# Altium schematic sheet TransPrj.SchDoc
size A0
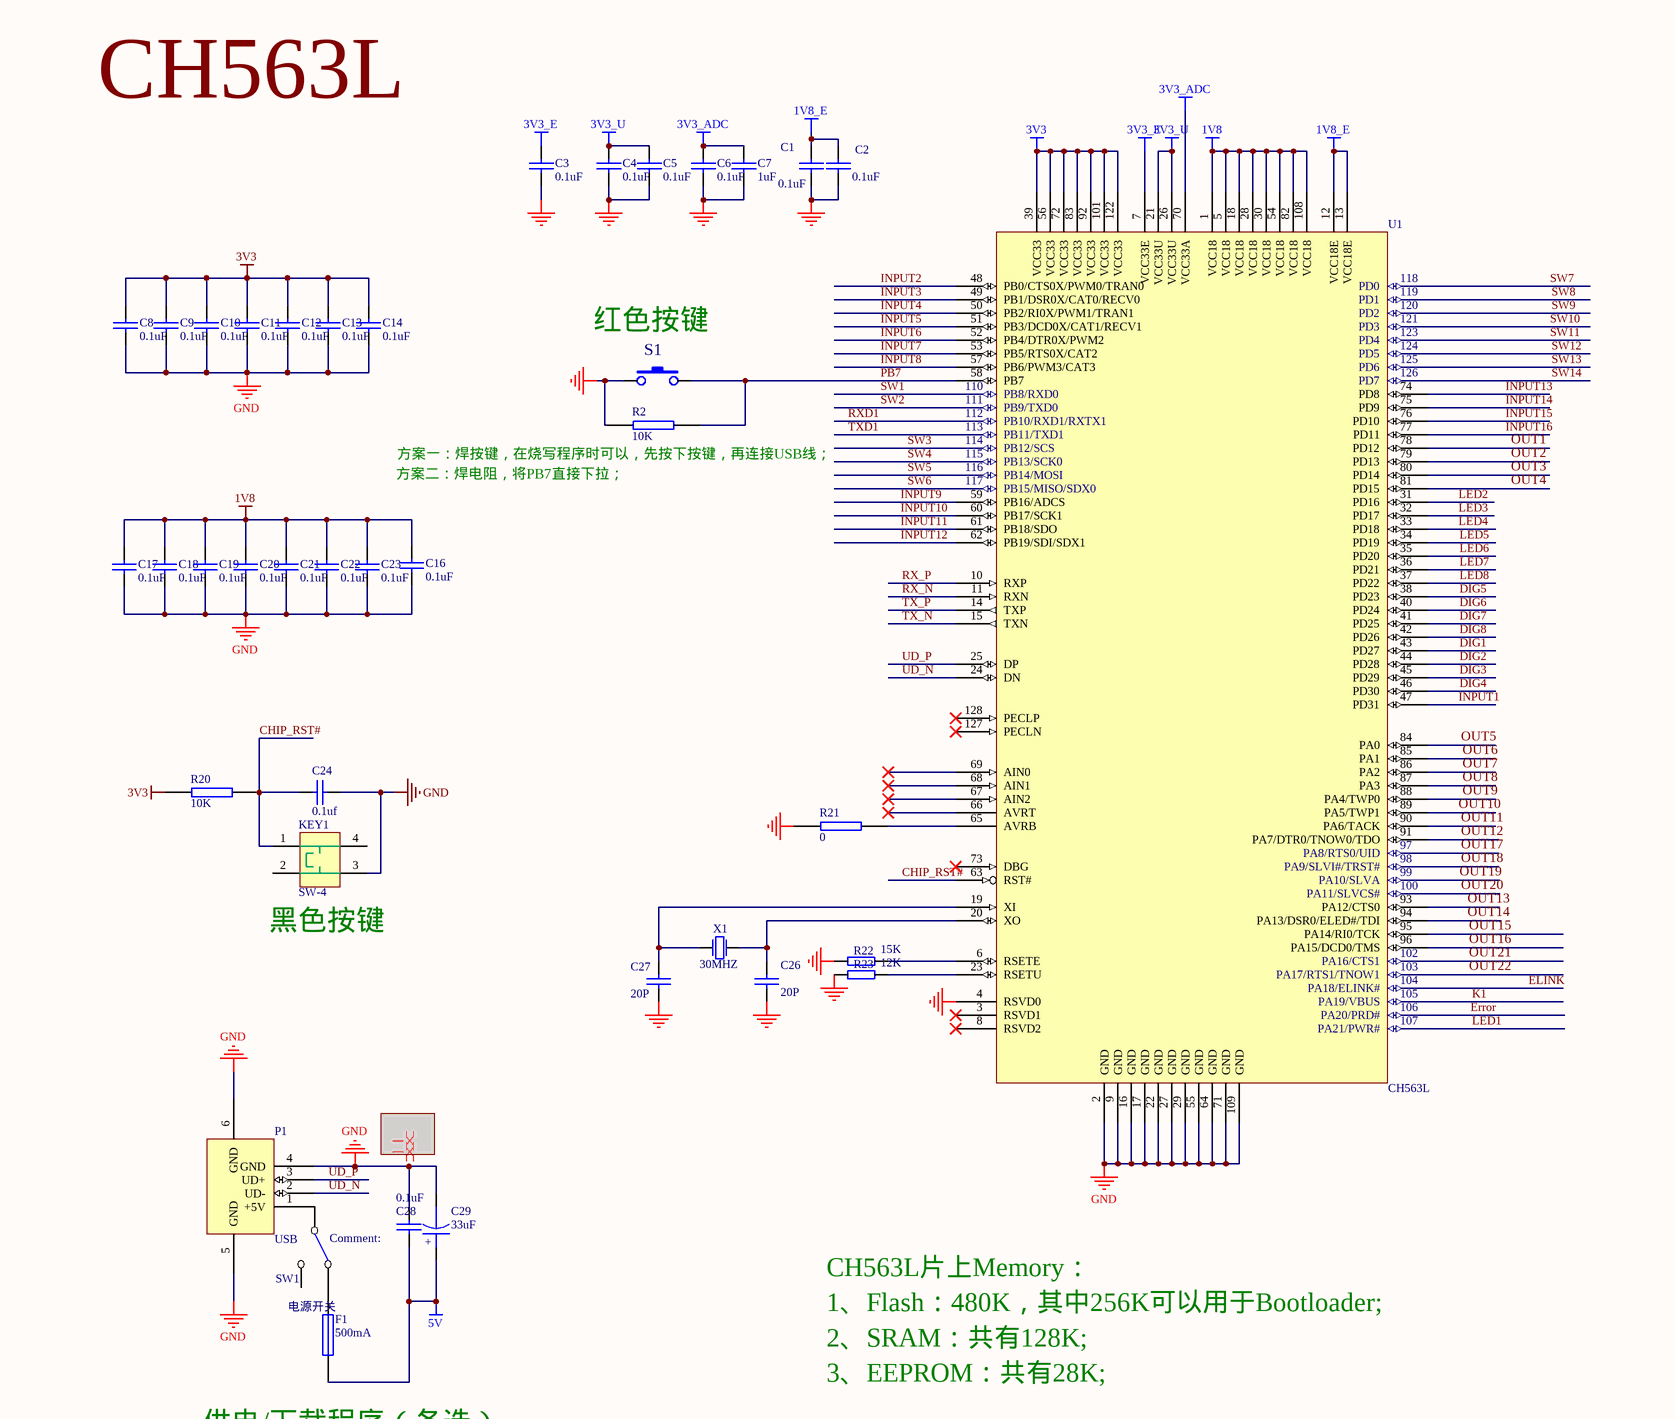
[diagram p0: TransPrj.SchDoc, top left]
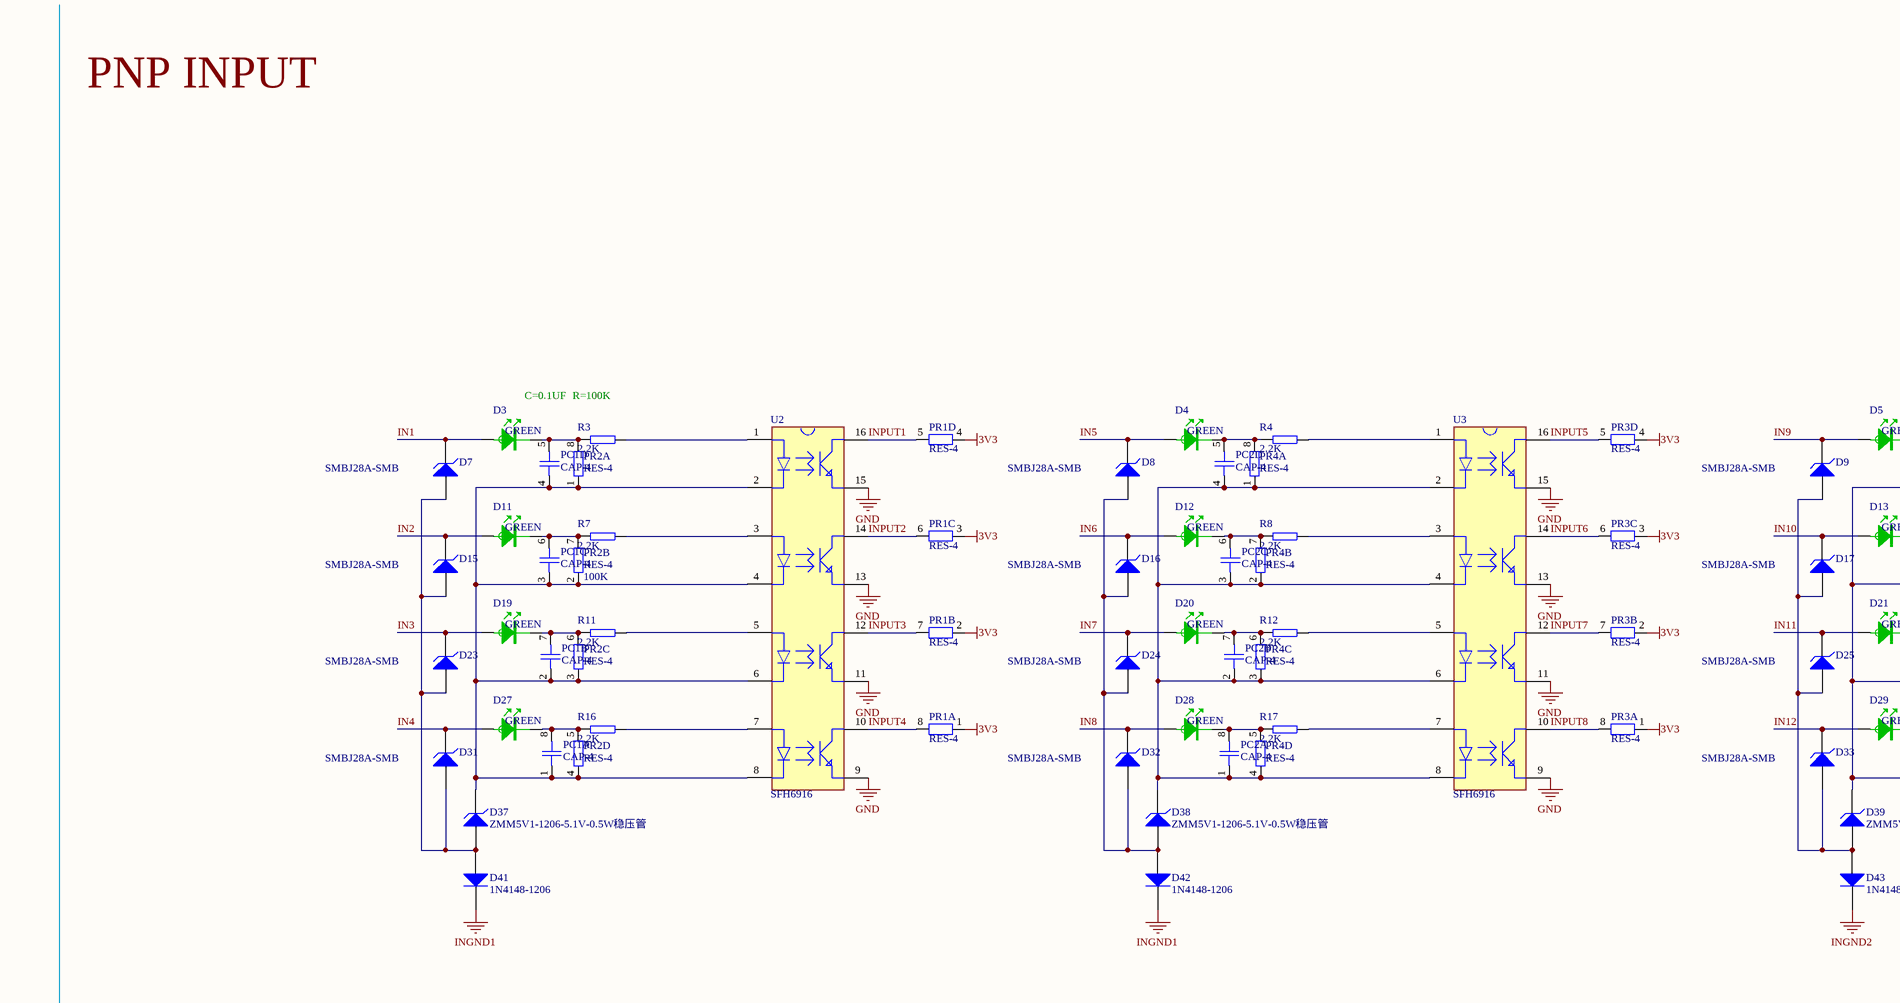
[diagram p1: TransPrj.SchDoc, top middle]
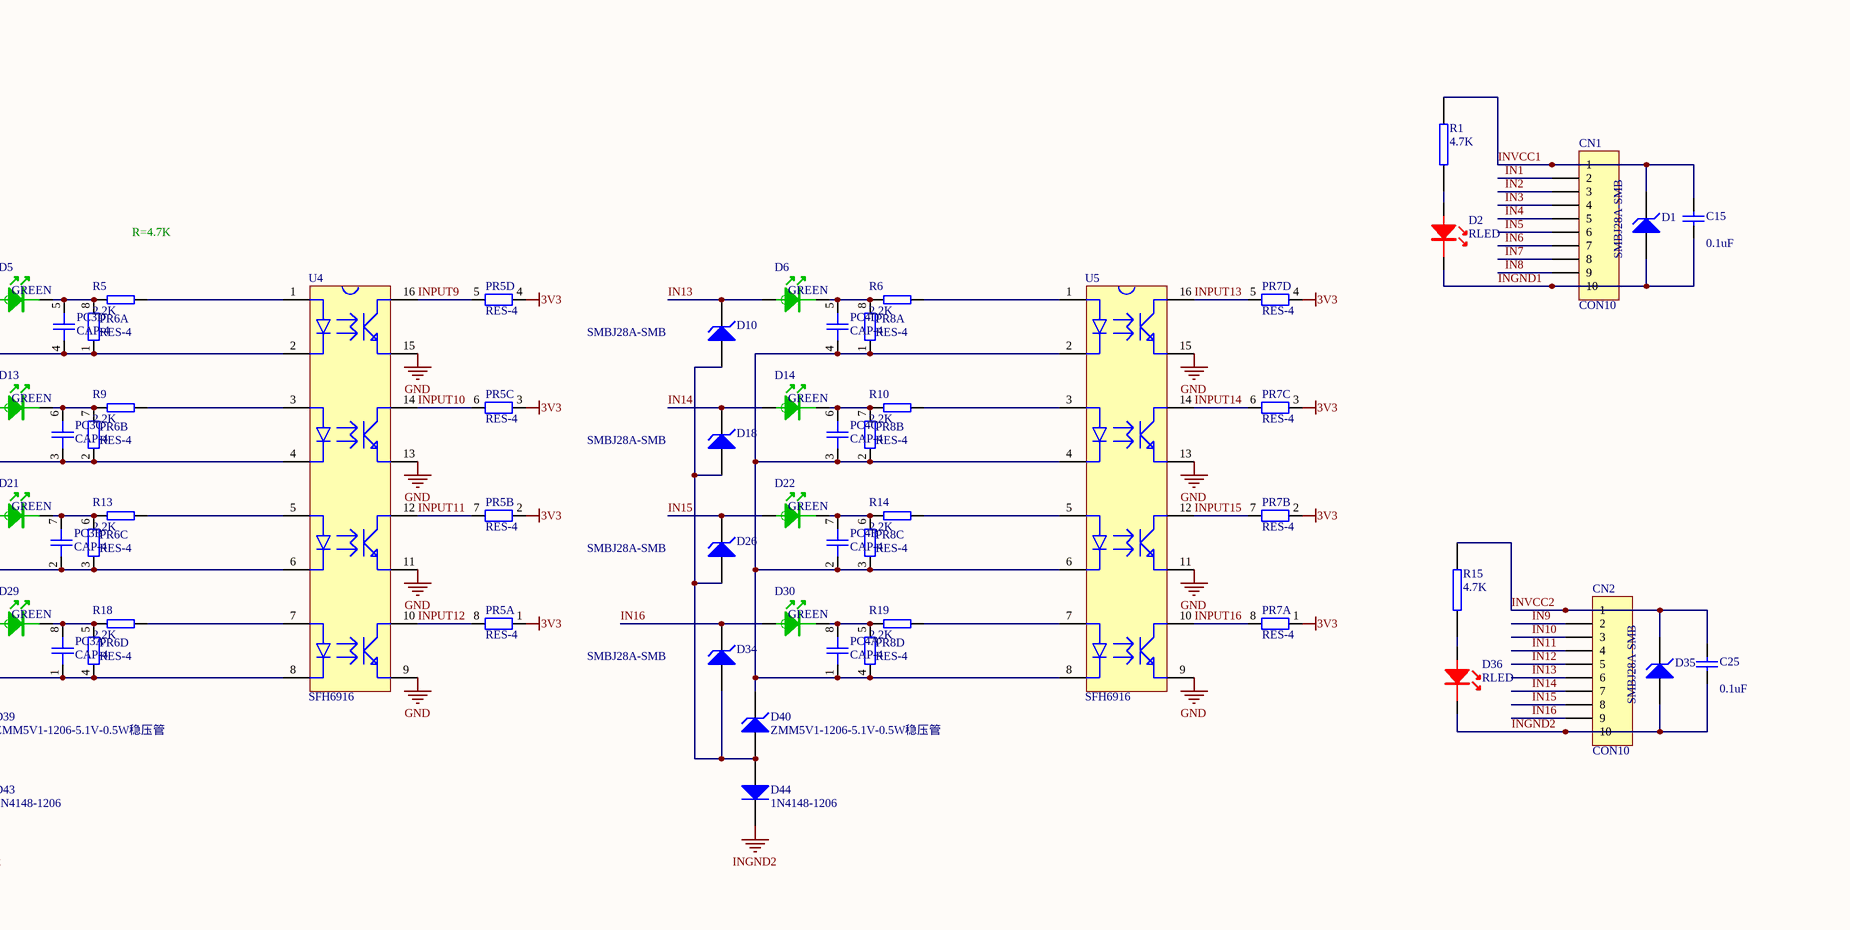
[diagram p2: TransPrj.SchDoc, top right]
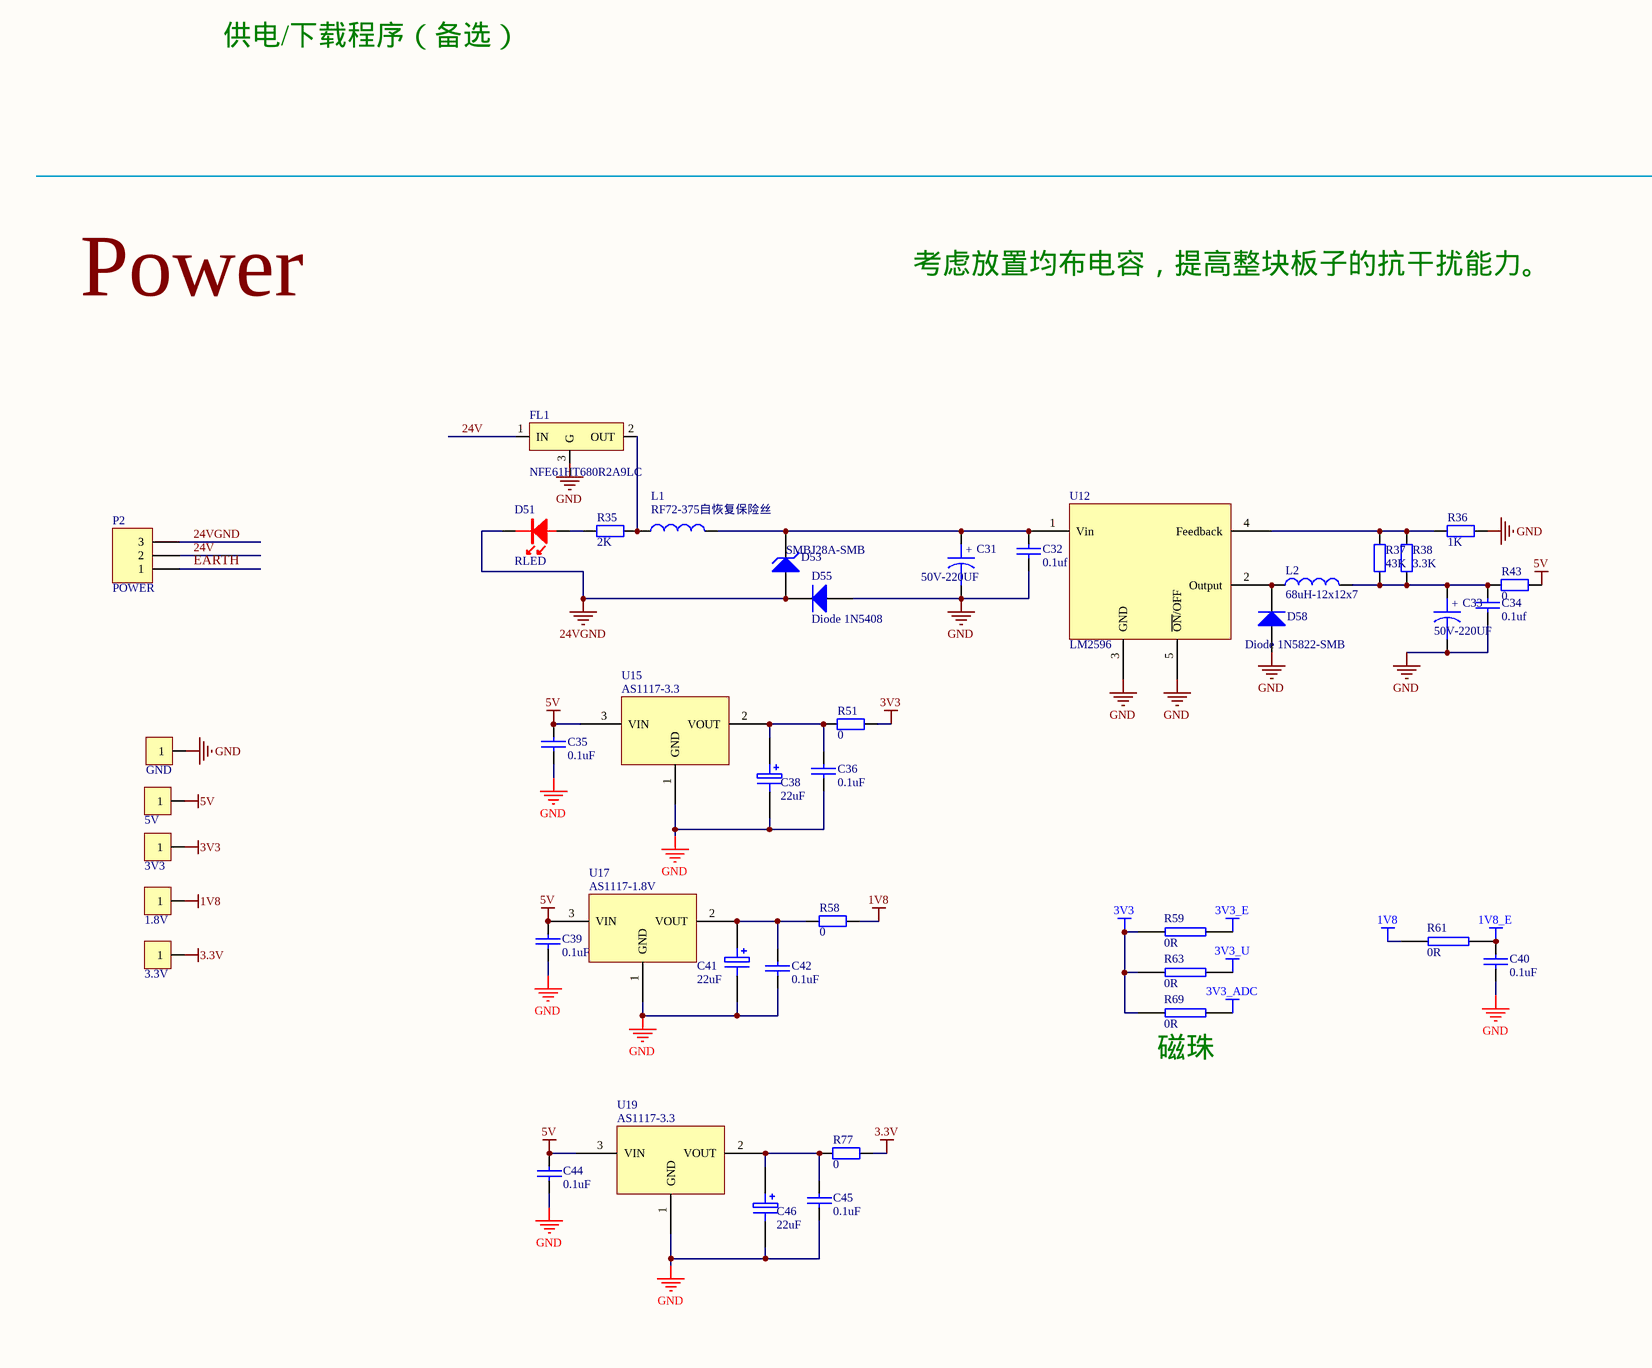
[diagram p3: TransPrj.SchDoc, centre left]
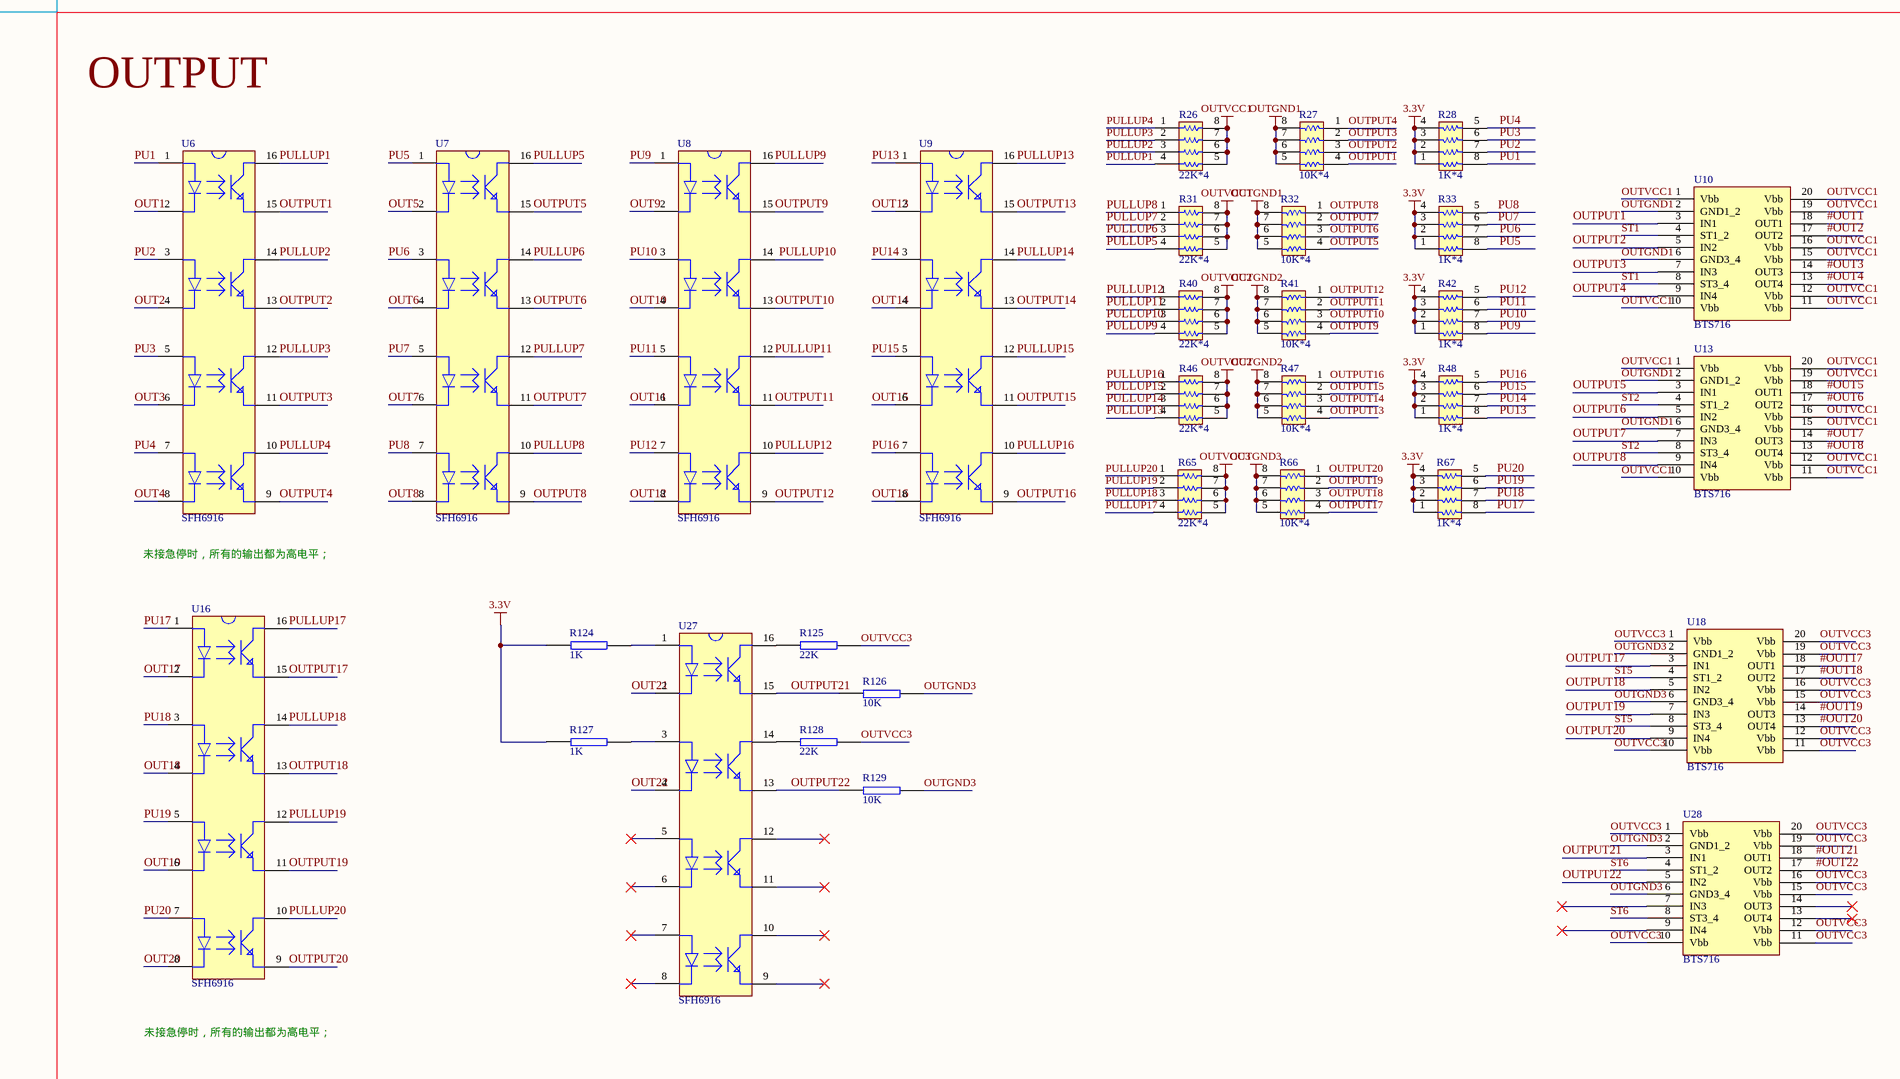
[diagram p4: TransPrj.SchDoc, centre middle]
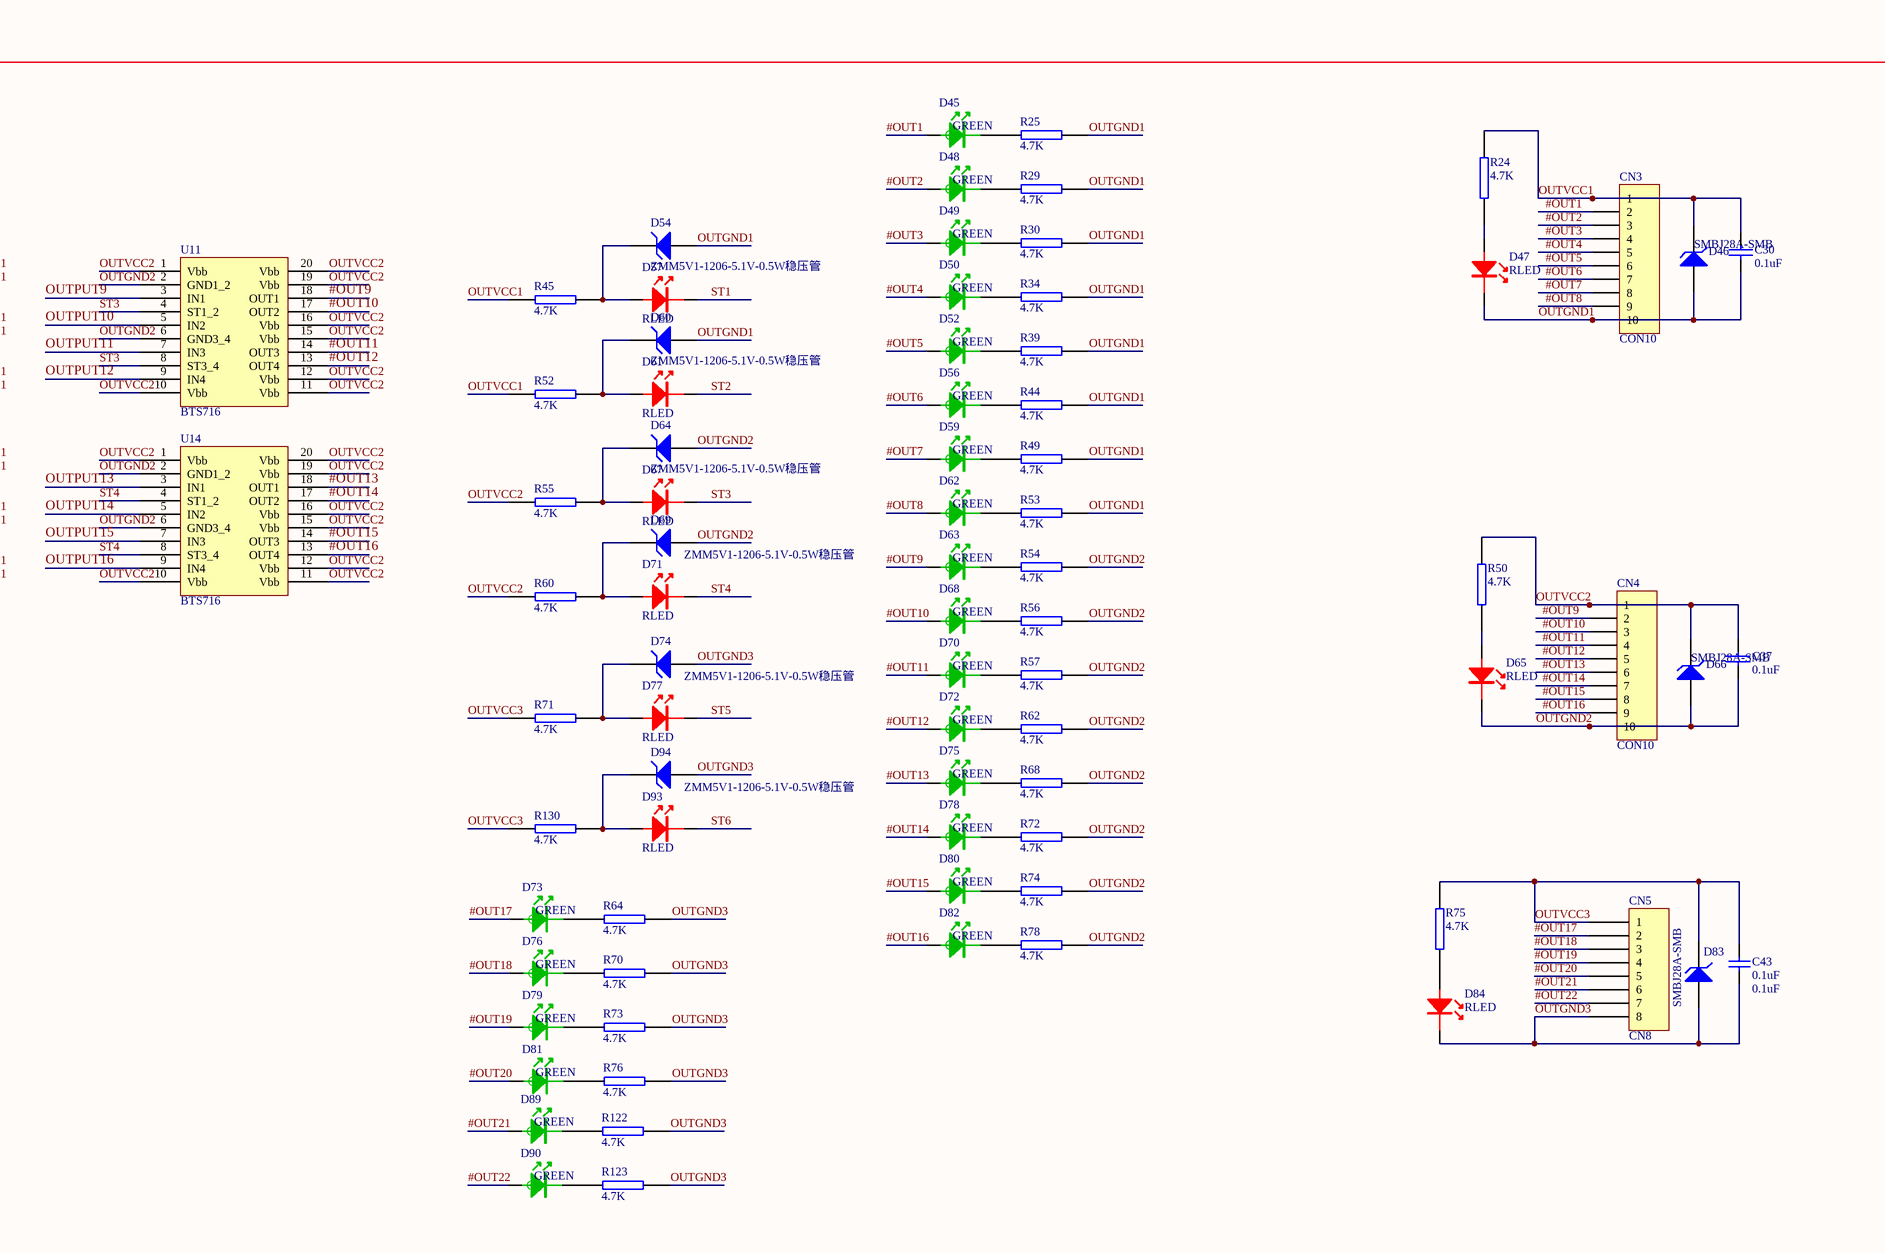
[diagram p5: TransPrj.SchDoc, centre right]
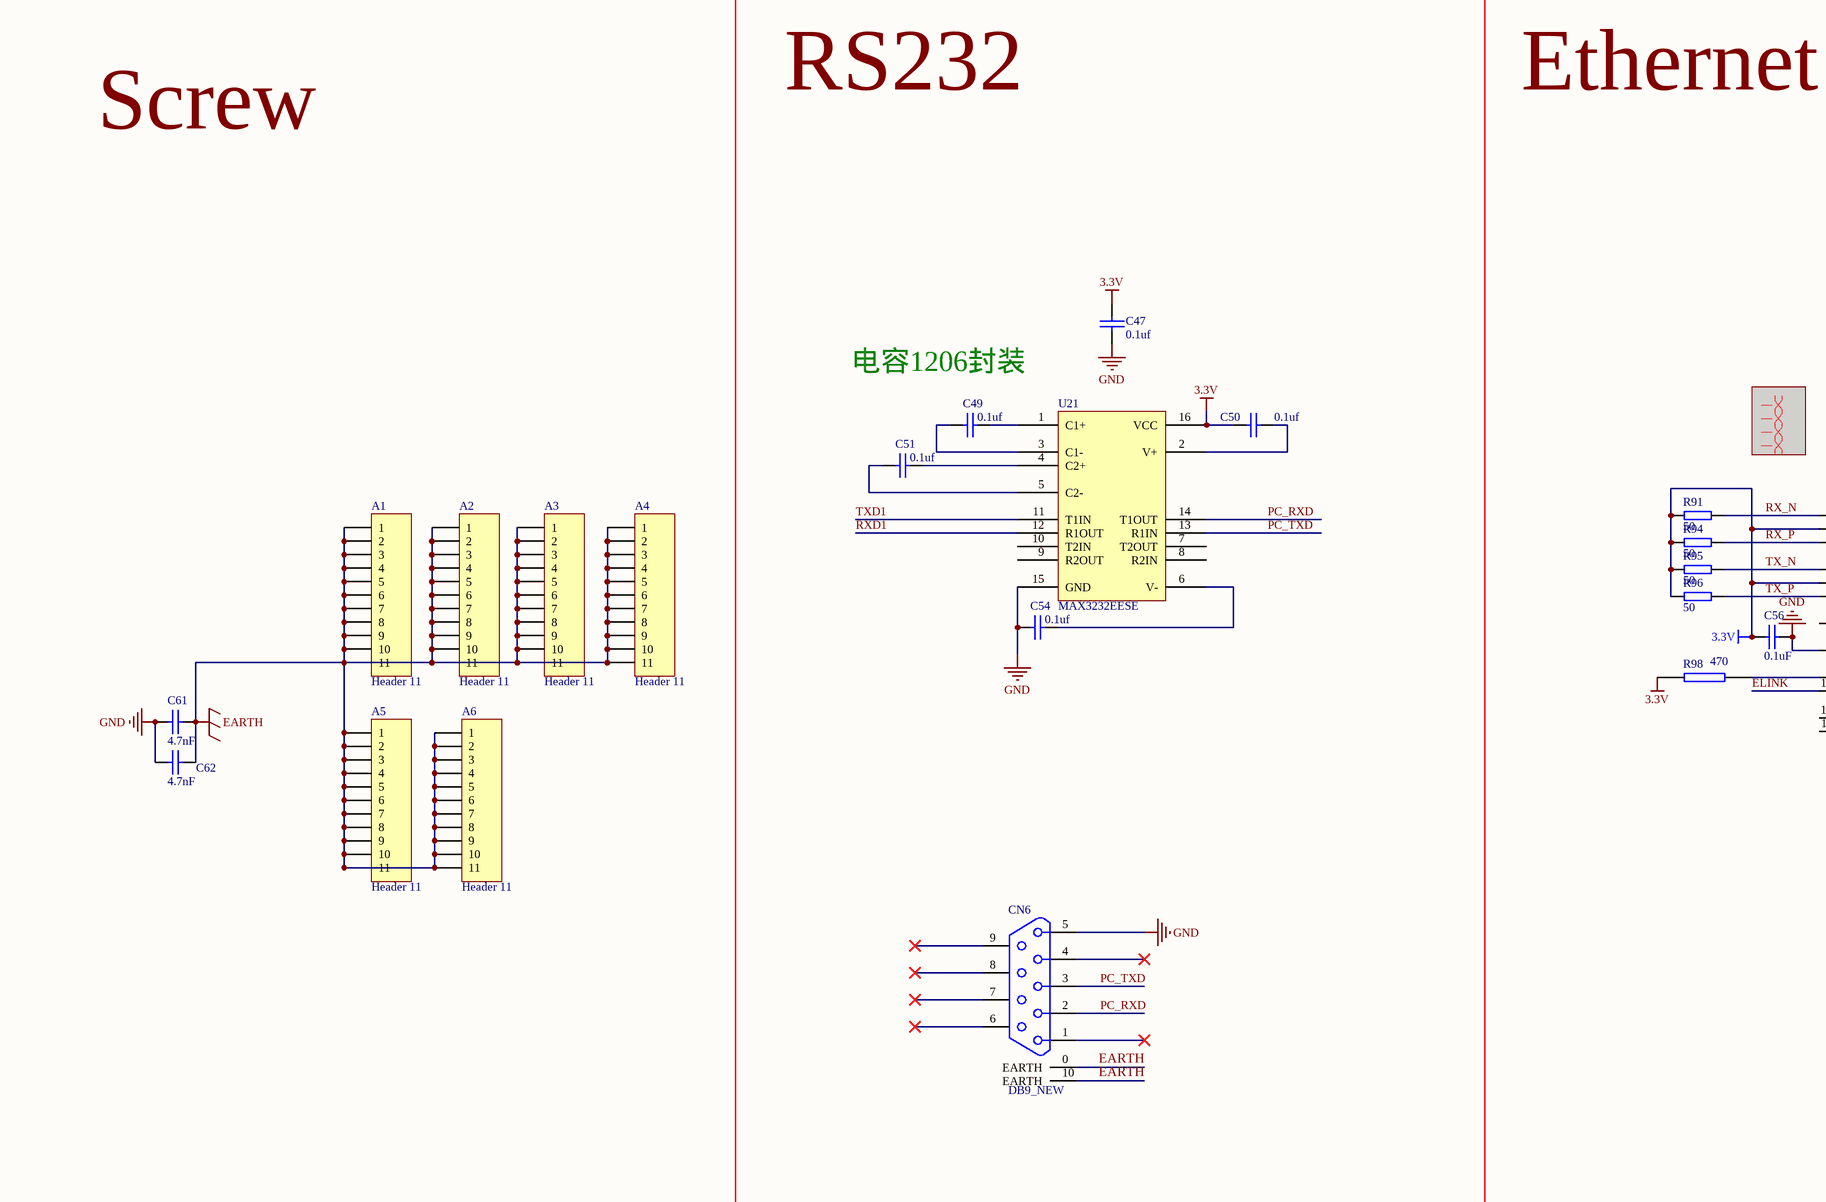
[diagram p6: TransPrj.SchDoc, bottom left]
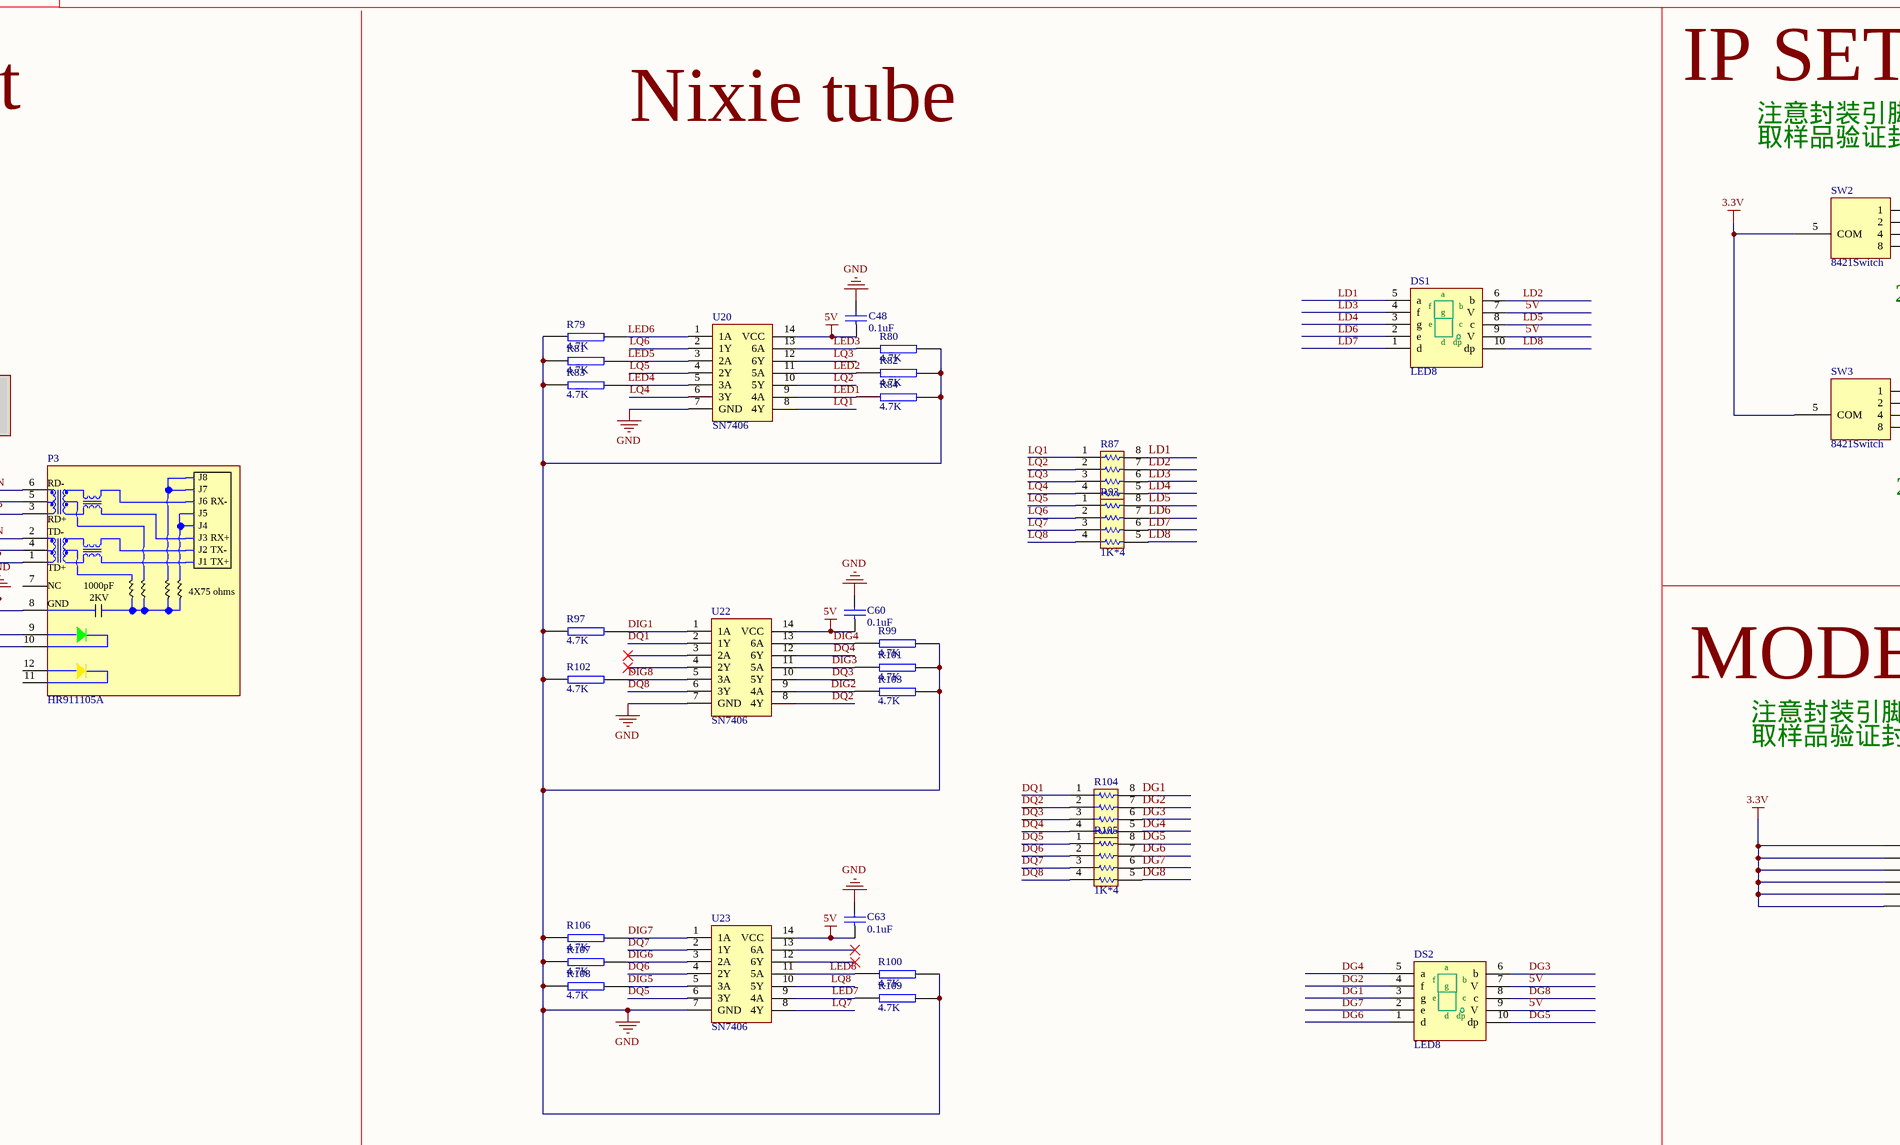
[diagram p7: TransPrj.SchDoc, bottom middle]
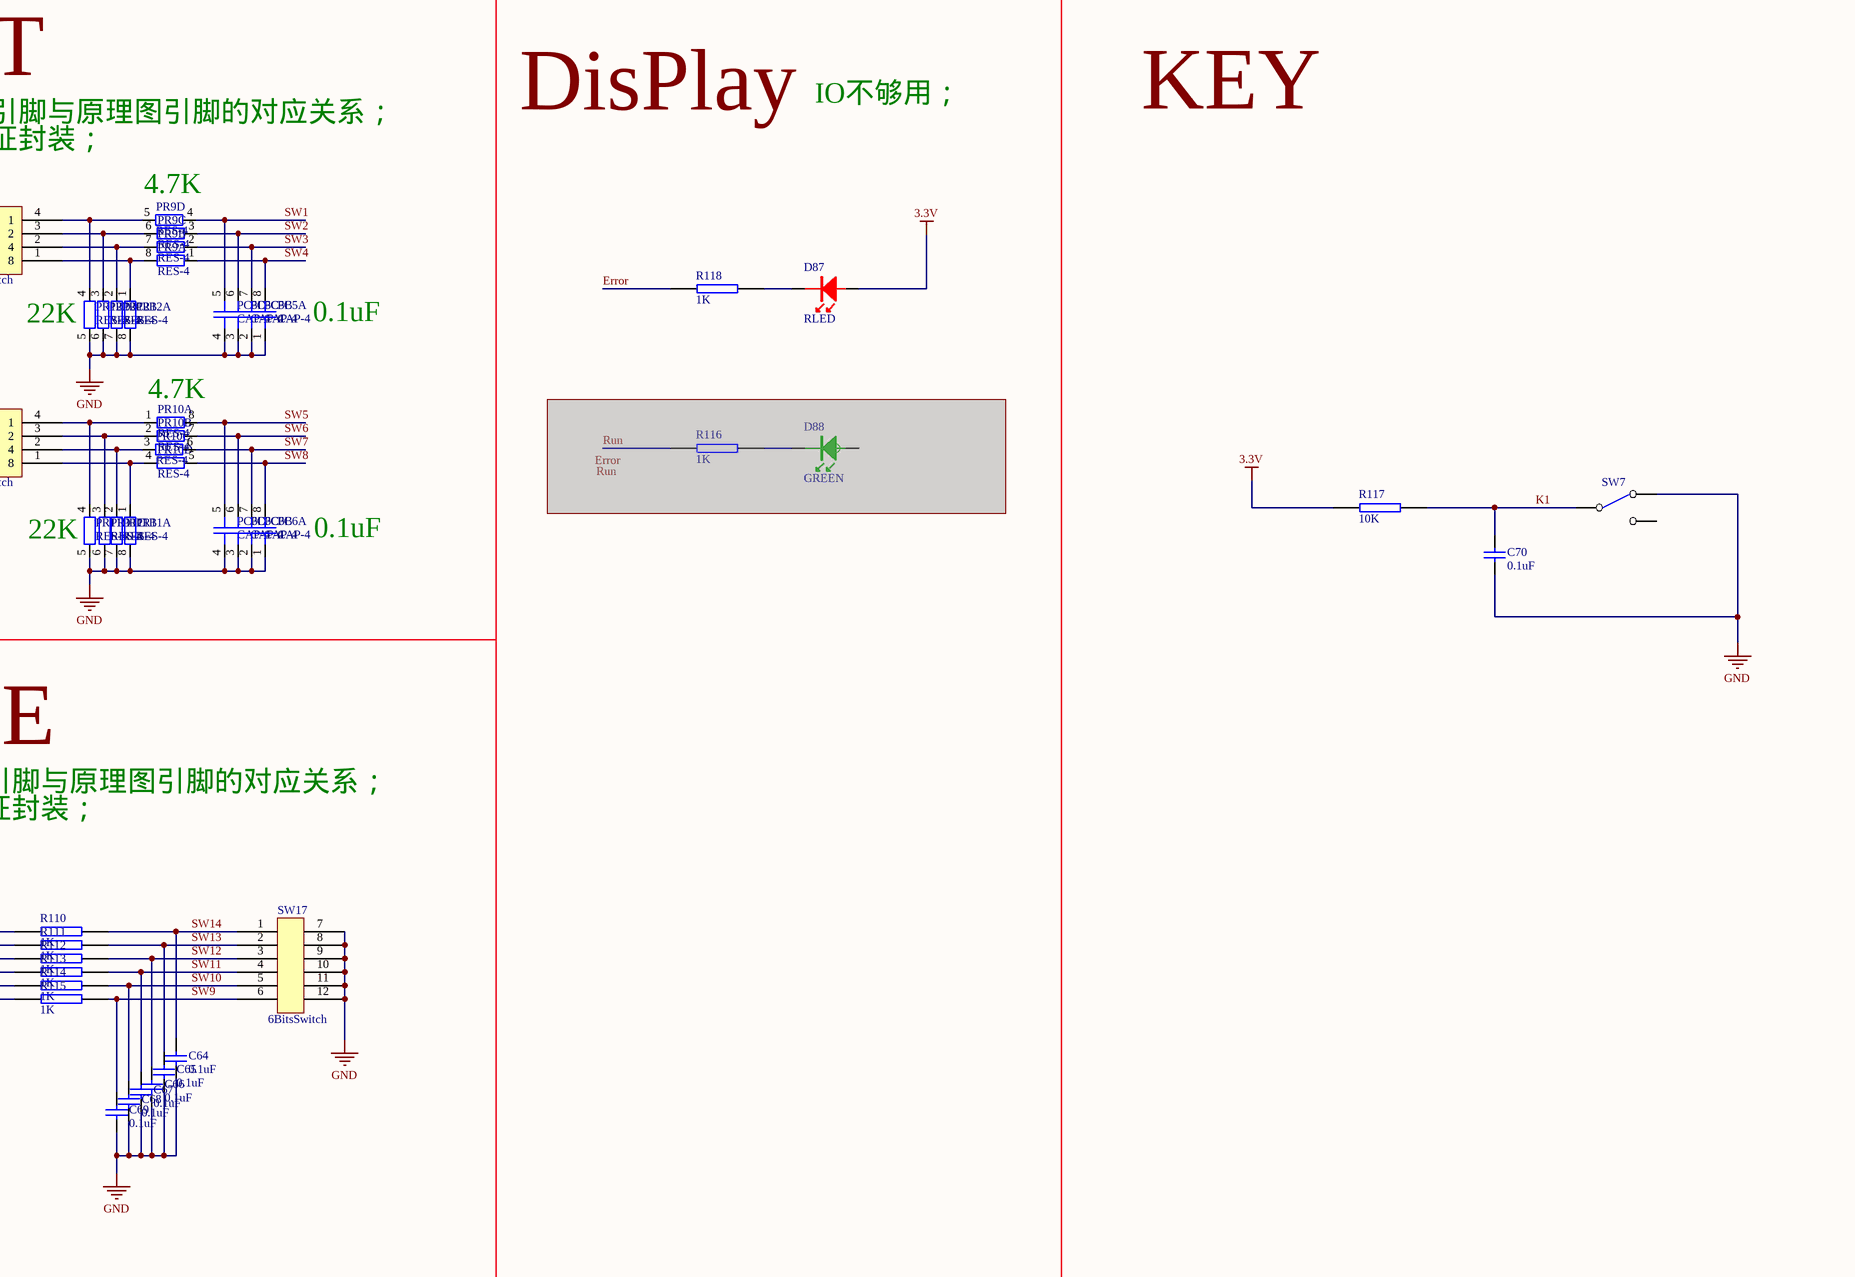
[diagram p8: TransPrj.SchDoc, bottom right]

## Parts
1.8V  TESTPOINT  [TESTPOINT]  (value not drawn)
3.3V  TESTPOINT  [TESTPOINT]  (value not drawn)
3V3  TESTPOINT  [TESTPOINT]  (value not drawn)
5V  TESTPOINT  [TESTPOINT]  (value not drawn)
A1  Header 11  [m3]
A2  Header 11  [m3]
A3  Header 11  [m3]
A4  Header 11  [m3]
A5  Header 11  [m3]
A6  Header 11  [m3]
C1  0.1uF  [0805_CAP]
C2  0.1uF  [0805_CAP]
C3  0.1uF  [0805_CAP]
C4  0.1uF  [0805_CAP]
C5  0.1uF  [0805_CAP]
C6  0.1uF  [0805_CAP]
C7  1uF  [0805_CAP]
C8  0.1uF  [0805_CAP]
C9  0.1uF  [0805_CAP]
C10  0.1uF  [0805_CAP]
C11  0.1uF  [0805_CAP]
C12  0.1uF  [0805_CAP]
C13  0.1uF  [0805_CAP]
C14  0.1uF  [0805_CAP]
C15  0.1uF  [0805_CAP]
C16  0.1uF  [0805_CAP]
C17  0.1uF  [0805_CAP]
C18  0.1uF  [0805_CAP]
C19  0.1uF  [0805_CAP]
C20  0.1uF  [0805_CAP]
C21  0.1uF  [0805_CAP]
C22  0.1uF  [0805_CAP]
C23  0.1uF  [0805_CAP]
C24  0.1uf  [0805_CAP]
C25  0.1uF  [0805_CAP]
C26  20P  [0805_CAP]
C27  20P  [0805_CAP]
C28  0.1uF  [0805_CAP]
C29  33uF  [3528]
C30  0.1uF  [0805_CAP]
C31  50V-220UF  [50V220UF]
C32  0.1uf  [0805_CAP]
C33  50V-220UF  [50V220UF]
C34  0.1uf  [0805_CAP]
C35  0.1uF  [0805_CAP]
C36  0.1uF  [0805_CAP]
C37  0.1uF  [0805_CAP]
C38  22uF  [3528]
C39  0.1uF  [0805_CAP]
C40  0.1uF  [0805_CAP]
C41  22uF  [3528]
C42  0.1uF  [0805_CAP]
C43  0.1uF  [0805_cap]
C44  0.1uF  [0805_CAP]
C45  0.1uF  [0805_CAP]
C46  22uF  [3528]
C47  0.1uf  [0805_CAP]
C48  0.1uF  [0603C]
C49  0.1uf  [1206]
C50  0.1uf  [1206]
C51  0.1uf  [1206]
C54  0.1uf  [1206]
C56  0.1uF  [0805_CAP]
C60  0.1uF  [0603C]
C61  4.7nF  [WIMA-CAP]
C62  4.7nF  [WIMA-CAP]
C63  0.1uF  [0603C]
C64  value 0.1uF  [0603C]  (hidden comment: Cap)
C65  value 0.1uF  [0603C]  (hidden comment: Cap)
C66  value 0.1uF  [0603C]  (hidden comment: Cap)
C67  value 0.1uF  [0603C]  (hidden comment: Cap)
C68  value 0.1uF  [0603C]  (hidden comment: Cap)
C69  value 0.1uF  [0603C]  (hidden comment: Cap)
C70  value 0.1uF  [0603C]  (hidden comment: Cap)
CN1  CON10  [I/O-10P]
CN2  CON10  [I/O-10P]
CN3  CON10  [I/O-10P]
CN4  CON10  [I/O-10P]
CN5  CN8  [8-FOOT]
CN6  DB9_NEW  [DB9/F_NEW(母头)]
D1  SMBJ28A-SMB  [SMB]
D2  RLED  [0805_POL]
D3  GREEN  [0805_pol]
D4  GREEN  [0805_pol]
D5  GREEN  [0805_pol]
D6  GREEN  [0805_pol]
D7  SMBJ28A-SMB  [SMB]
D8  SMBJ28A-SMB  [SMB]
D9  SMBJ28A-SMB  [SMB]
D10  SMBJ28A-SMB  [SMB]
D11  GREEN  [0805_pol]
D12  GREEN  [0805_pol]
D13  GREEN  [0805_pol]
D14  GREEN  [0805_pol]
D15  SMBJ28A-SMB  [SMB]
D16  SMBJ28A-SMB  [SMB]
D17  SMBJ28A-SMB  [SMB]
D18  SMBJ28A-SMB  [SMB]
D19  GREEN  [0805_pol]
D20  GREEN  [0805_pol]
D21  GREEN  [0805_pol]
D22  GREEN  [0805_pol]
D23  SMBJ28A-SMB  [SMB]
D24  SMBJ28A-SMB  [SMB]
D25  SMBJ28A-SMB  [SMB]
D26  SMBJ28A-SMB  [SMB]
D27  GREEN  [0805_pol]
D28  GREEN  [0805_pol]
D29  GREEN  [0805_pol]
D30  GREEN  [0805_pol]
D31  SMBJ28A-SMB  [SMB]
D32  SMBJ28A-SMB  [SMB]
D33  SMBJ28A-SMB  [SMB]
D34  SMBJ28A-SMB  [SMB]
D35  SMBJ28A-SMB  [SMB]
D36  RLED  [0805_POL]
D37  ZMM5V1-1206-5.1V-0.5W稳压管  [1206_P]
D38  ZMM5V1-1206-5.1V-0.5W稳压管  [1206_P]
D39  ZMM5V1-1206-5.1V-0.5W稳压管  [1206_P]
D40  ZMM5V1-1206-5.1V-0.5W稳压管  [1206_P]
D41  1N4148-1206  [1206_P]
D42  1N4148-1206  [1206_P]
D43  1N4148-1206  [1206_P]
D44  1N4148-1206  [1206_P]
D45  GREEN  [0805_pol]
D46  SMBJ28A-SMB  [SMB]
D47  RLED  [0805_POL]
D48  GREEN  [0805_pol]
D49  GREEN  [0805_pol]
D50  GREEN  [0805_pol]
D51  RLED  [DIP-2]
D52  GREEN  [0805_pol]
D53  SMBJ28A-SMB  [SMB]
D54  ZMM5V1-1206-5.1V-0.5W稳压管  [1206_P]
D55  Diode 1N5408  [bigdiode]
D56  GREEN  [0805_pol]
D57  RLED  [0805_POL]
D58  Diode 1N5822-SMB  [SMB]
D59  GREEN  [0805_pol]
D60  ZMM5V1-1206-5.1V-0.5W稳压管  [1206_P]
D61  RLED  [0805_POL]
D62  GREEN  [0805_pol]
D63  GREEN  [0805_pol]
D64  ZMM5V1-1206-5.1V-0.5W稳压管  [1206_P]
D65  RLED  [0805_POL]
D66  SMBJ28A-SMB  [SMB]
D67  RLED  [0805_POL]
D68  GREEN  [0805_pol]
D69  ZMM5V1-1206-5.1V-0.5W稳压管  [1206_P]
D70  GREEN  [0805_pol]
D71  RLED  [0805_POL]
D72  GREEN  [0805_pol]
D73  GREEN  [0805_pol]
D74  ZMM5V1-1206-5.1V-0.5W稳压管  [1206_P]
D75  GREEN  [0805_pol]
D76  GREEN  [0805_pol]
D77  RLED  [0805_POL]
D78  GREEN  [0805_pol]
D79  GREEN  [0805_pol]
D80  GREEN  [0805_pol]
D81  GREEN  [0805_pol]
D82  GREEN  [0805_pol]
D83  SMBJ28A-SMB  [SMB]
D84  RLED  [0805_POL]
D87  RLED  [0805_POL]
D88  GREEN  [0805_pol]  (masked out: inside a compile mask, not in the netlist)
D89  GREEN  [0805_pol]
D90  GREEN  [0805_pol]
D93  RLED  [0805_POL]
D94  ZMM5V1-1206-5.1V-0.5W稳压管  [1206_P]
DS1  LED8  [10LED]
DS2  LED8  [10LED]
F1  500mA  [0805]
FL1  NFE61HT680R2A9LC  [LONG]
GND  TESTPOINT  [TESTPOINT]  (value not drawn)
KEY1  SW-4  [SW]
L1  RF72-375自恢复保险丝  [AXIAL-0.4]
L2  68uH-12x12x7  [INDM125120X70N]
P1  USB  [USBA_L]
P2  POWER  [POWER3l]
P3  HR911105A  [RJ45A]
PC1  CAP-4  [0603-4]  (parts A,B,C,D of 4)
PC2  CAP-4  [0603-4]  (parts A,B,C,D of 4)
PC3  CAP-4  [0603-4]  (parts A,B,C,D of 4)
PC4  CAP-4  [0603-4]  (parts A,B,C,D of 4)
PC5  CAP-4  [0603-4]  (parts A,B,C,D of 4)
PC6  CAP-4  [0603-4]  (parts A,B,C,D of 4)
PR1  RES-4  [0603-4]  (parts A,B,C,D of 4)
PR2  RES-4  [0603-4]  (parts A,B,C,D of 4)
PR3  RES-4  [0603-4]  (parts A,B,C,D of 4)
PR4  RES-4  [0603-4]  (parts A,B,C,D of 4)
PR5  RES-4  [0603-4]  (parts A,B,C,D of 4)
PR6  RES-4  [0603-4]  (parts A,B,C,D of 4)
PR7  RES-4  [0603-4]  (parts A,B,C,D of 4)
PR8  RES-4  [0603-4]  (parts A,B,C,D of 4)
PR9  RES-4  [0603-4]  (parts A,B,C,D of 4)
PR10  RES-4  [0603-4]  (parts A,B,C,D of 4)
PR11  RES-4  [0603-4]  (parts A,B,C,D of 4)
PR12  RES-4  [0603-4]  (parts A,B,C,D of 4)
R1  4.7K  [0805]
R2  10K  [0805]
R3  2.2K  [1206]
R4  2.2K  [1206]
R5  2.2K  [1206]
R6  2.2K  [1206]
R7  2.2K  [1206]
R8  2.2K  [1206]
R9  2.2K  [1206]
R10  2.2K  [1206]
R11  2.2K  [1206]
R12  2.2K  [1206]
R13  2.2K  [1206]
R14  2.2K  [1206]
R15  4.7K  [0805]
R16  2.2K  [1206]
R17  2.2K  [1206]
R18  2.2K  [1206]
R19  2.2K  [1206]
R20  10K  [0805]
R21  0  [0805]
R22  15K  [0805]
R23  12K  [0805]
R24  4.7K  [0805]
R25  4.7K  [0805]
R26  22K*4  [0603-4]
R27  10K*4  [0603-4]
R28  1K*4  [0603-4]
R29  4.7K  [0805]
R30  4.7K  [0805]
R31  22K*4  [0603-4]
R32  10K*4  [0603-4]
R33  1K*4  [0603-4]
R34  4.7K  [0805]
R35  2K  [0805]
R36  1K  [0805]
R37  43K  [0805]
R38  3.3K  [0805]
R39  4.7K  [0805]
R40  22K*4  [0603-4]
R41  10K*4  [0603-4]
R42  1K*4  [0603-4]
R43  0  [0805]
R44  4.7K  [0805]
R45  4.7K  [0805]
R46  22K*4  [0603-4]
R47  10K*4  [0603-4]
R48  1K*4  [0603-4]
R49  4.7K  [0805]
R50  4.7K  [0805]
R51  0  [0805]
R52  4.7K  [0805]
R53  4.7K  [0805]
R54  4.7K  [0805]
R55  4.7K  [0805]
R56  4.7K  [0805]
R57  4.7K  [0805]
R58  0  [0805]
R59  0R  [0805]
R60  4.7K  [0805]
R61  0R  [0805]
R62  4.7K  [0805]
R63  0R  [0805]
R64  4.7K  [0805]
R65  22K*4  [0603-4]
R66  10K*4  [0603-4]
R67  1K*4  [0603-4]
R68  4.7K  [0805]
R69  0R  [0805]
R70  4.7K  [0805]
R71  4.7K  [0805]
R72  4.7K  [0805]
R73  4.7K  [0805]
R74  4.7K  [0805]
R75  4.7K  [0805]
R76  4.7K  [0805]
R77  0  [0805]
R78  4.7K  [0805]
R79  4.7K  [0603R]
R80  4.7K  [0603R]
R81  4.7K  [0603R]
R82  4.7K  [0603R]
R83  4.7K  [0603R]
R84  4.7K  [0603R]
R87  1K*4  [0603-4]
R91  50  [0805]
R93  1K*4  [0603-4]
R94  50  [0805]
R95  50  [0805]
R96  50  [0805]
R97  4.7K  [0603R]
R98  470  [0805]
R99  4.7K  [0603R]
R100  4.7K  [0603R]
R101  4.7K  [0603R]
R102  4.7K  [0603R]
R103  4.7K  [0603R]
R104  1K*4  [0603-4]
R105  1K*4  [0603-4]
R106  4.7K  [0603R]
R107  4.7K  [0603R]
R108  4.7K  [0603R]
R109  4.7K  [0603R]
R110  1K  [0603R]
R111  1K  [0603R]
R112  1K  [0603R]
R113  1K  [0603R]
R114  1K  [0603R]
R115  1K  [0603R]
R116  1K  [0603R]  (masked out: inside a compile mask, not in the netlist)
R117  10K  [0603R]
R118  1K  [0603R]
R122  4.7K  [0805]
R123  4.7K  [0805]
R124  1K  [0805]
R125  22K  [0805]
R126  10K  [0805]
R127  1K  [0805]
R128  22K  [0805]
R129  10K  [0805]
R130  4.7K  [0805]
S1  (no value)  [KEYX]
SW1  (no value)  [KEY_B]
SW2  8421Switch  [ERD40160_M]
SW3  8421Switch  [ERD40160_M]
SW7  (no value)  [KEY_B]
SW17  6BitsSwitch  [2.54mm拨码开关（6Bits）]
U1  CH563L  [LQFP128]
U2  SFH6916  [SFH6916]
U3  SFH6916  [SFH6916]
U4  SFH6916  [SFH6916]
U5  SFH6916  [SFH6916]
U6  SFH6916  [SFH6916]
U7  SFH6916  [SFH6916]
U8  SFH6916  [SFH6916]
U9  SFH6916  [SFH6916]
U10  BTS716  [BSOP-20]
U11  BTS716  [BSOP-20]
U12  LM2596  [LM2596]
U13  BTS716  [BSOP-20]
U14  BTS716  [BSOP-20]
U15  AS1117-3.3  [ADP3338]
U16  SFH6916  [SFH6916]
U17  AS1117-1.8V  [ADP3338]
U18  BTS716  [BSOP-20]
U19  AS1117-3.3  [ADP3338]
U20  SN7406  [SOP-14]
U21  MAX3232EESE  [MAX232]
U22  SN7406  [SOP-14]
U23  SN7406  [SOP-14]
U27  SFH6916  [SFH6916]
U28  BTS716  [BSOP-20]
X1  30MHZ  [XTAL62/28]

## Nets
1V8: 1.8V.1 C16.1 C17.1 C18.1 C19.1 C20.1 C21.1 C22.1 C23.1 R58.1 R61.1 U1.1(VCC18) U1.5(VCC18) U1.18(VCC18) U1.28(VCC18) U1.30(VCC18) U1.54(VCC18) U1.82(VCC18) U1.108(VCC18)
1V8_E: C1.1 C2.1 C40.1 R61.2 U1.12(VCC18E) U1.13(VCC18E)
3.3V: 3.3V.1 C47.1 C50.1 C56.1 D87.1 P3.4 P3.5 R28.1 R28.2 R28.3 R28.4 R33.1 R33.2 R33.3 R33.4 R42.1 R42.2 R42.3 R42.4 R48.1 R48.2 R48.3 R48.4 R67.1 R67.2 R67.3 R67.4 R77.1 R91.2 R94.1 R95.2 R96.2 R98.1 R110.1 R111.1 R112.1 R113.1 R114.1 R115.1 R117.1 R124.1 R127.1 SW2.5(COM) SW3.5(COM) U21.16(VCC)
3V3: 3V3.1 C8.1 C9.1 C10.1 C11.1 C12.1 C13.1 C14.1 PR1.1 PR1.2 PR1.3 PR1.4 PR3.1 PR3.2 PR3.3 PR3.4 PR5.1 PR5.2 PR5.3 PR5.4 PR7.1 PR7.2 PR7.3 PR7.4 R20.2 R51.1 R59.1 R63.1 R69.1 U1.39(VCC33) U1.56(VCC33) U1.72(VCC33) U1.83(VCC33) U1.92(VCC33) U1.101(VCC33) U1.122(VCC33)
3V3_ADC: C6.1 C7.1 R69.2 U1.70(VCC33A)
3V3_E: C3.1 R59.2 U1.7(VCC33E)
3V3_U: C4.1 C5.1 R63.2 U1.21(VCC33U) U1.26(VCC33U)
5V: 5V.1 C28.2 C29.1 C35.1 C39.1 C44.1 C48.1 C60.1 C63.1 DS1.7(V) DS1.9(V) DS2.7(V) DS2.9(V) F1.1 R43.1 U15.3(VIN) U17.3(VIN) U19.3(VIN) U20.14(VCC) U22.14(VCC) U23.14(VCC)
24VGND: D51.2 D53.1(A) D55.2(K) P2.3
EARTH: A1.1 A1.2 A1.3 A1.4 A1.5 A1.6 A1.7 A1.8 A1.9 A1.10 A1.11 A2.1 A2.2 A2.3 A2.4 A2.5 A2.6 A2.7 A2.8 A2.9 A2.10 A2.11 A3.1 A3.2 A3.3 A3.4 A3.5 A3.6 A3.7 A3.8 A3.9 A3.10 A3.11 A4.1 A4.2 A4.3 A4.4 A4.5 A4.6 A4.7 A4.8 A4.9 A4.10 A4.11 A5.1 A5.2 A5.3 A5.4 A5.5 A5.6 A5.7 A5.8 A5.9 A5.10 A5.11 A6.1 A6.2 A6.3 A6.4 A6.5 A6.6 A6.7 A6.8 A6.9 A6.10 A6.11 C61.1 C62.1 CN6.0(EARTH) CN6.10(EARTH) P2.1
GND: C1.2 C2.2 C3.2 C4.2 C5.2 C6.2 C7.2 C8.2 C9.2 C10.2 C11.2 C12.2 C13.2 C14.2 C16.2 C17.2 C18.2 C19.2 C20.2 C21.2 C22.2 C23.2 C24.2 C26.2 C27.2 C28.1 C29.2 C31.2 C32.1 C33.2 C34.1 C35.2 C36.2 C38.2 C39.2 C40.2 C41.2 C42.2 C44.2 C45.2 C46.2 C47.2 C48.2 C54.1 C56.2 C60.2 C61.2 C62.2 C63.2 C64.1 C65.1 C66.1 C67.1 C68.1 C69.1 C70.1 CN6.5 D55.1(A) D58.1(A) FL1.3(G) GND.1 KEY1.3 P1.4(GND) P1.5(GND) P1.6(GND) P3.8 PC5.1 PC5.2 PC5.3 PC5.4 PC6.1 PC6.2 PC6.3 PC6.4 PR11.5 PR11.6 PR11.7 PR11.8 PR12.5 PR12.6 PR12.7 PR12.8 R2.1 R21.1 R22.1 R23.1 R36.1 R79.1 R80.2 R81.1 R82.2 R83.1 R84.2 R97.1 R99.2 R100.2 R101.2 R102.1 R103.2 R106.1 R107.1 R108.1 R109.2 S1.1 SW7.2(NC) SW17.7 SW17.8 SW17.9 SW17.10 SW17.11 SW17.12 U1.2(GND) U1.4(RSVD0) U1.9(GND) U1.16(GND) U1.17(GND) U1.22(GND) U1.27(GND) U1.29(GND) U1.55(GND) U1.64(GND) U1.71(GND) U1.109(GND) U2.9 U2.11 U2.13 U2.15 U3.9 U3.11 U3.13 U3.15 U4.9 U4.11 U4.13 U4.15 U5.9 U5.11 U5.13 U5.15 U12.3(GND) U12.5(~{ON}/OFF) U15.1(GND) U17.1(GND) U19.1(GND) U20.7(GND) U21.15(GND) U22.7(GND) U23.7(GND)
INGND1: C15.2 CN1.10 D1.1(A) D2.2 D41.2(K) D42.2(K)
INGND2: C25.2 CN2.10 D35.1(A) D36.2 D43.2(K) D44.2(K)
OUTGND1: C30.2 CN3.10 D46.1(A) D47.2 D54.1(A) D60.1(A) R25.2 R27.5 R27.6 R27.7 R27.8 R29.2 R30.2 R32.5 R32.6 R32.7 R32.8 R34.2 R39.2 R44.2 R49.2 R53.2 U10.2(GND1_2) U10.6(GND3_4) U13.2(GND1_2) U13.6(GND3_4)
OUTGND2: C37.2 CN4.10 D64.1(A) D65.2 D66.1(A) D69.1(A) R41.5 R41.6 R41.7 R41.8 R47.5 R47.6 R47.7 R47.8 R54.2 R56.2 R57.2 R62.2 R68.2 R72.2 R74.2 R78.2 U11.2(GND1_2) U11.6(GND3_4) U14.2(GND1_2) U14.6(GND3_4)
OUTGND3: C43.2 CN5.8 D74.1(A) D83.1(A) D84.2 D94.1(A) R64.2 R66.5 R66.6 R66.7 R66.8 R70.2 R73.2 R76.2 R122.2 R123.2 R126.2 R129.2 U18.2(GND1_2) U18.6(GND3_4) U28.2(GND1_2) U28.6(GND3_4)
OUTVCC1: C30.1 CN3.1 D46.2(K) R24.1 R26.5 R26.6 R26.7 R26.8 R31.5 R31.6 R31.7 R31.8 R45.1 R52.1 U10.1(Vbb) U10.10(Vbb) U10.11(Vbb) U10.12(Vbb) U10.15(Vbb) U10.16(Vbb) U10.19(Vbb) U10.20(Vbb) U13.1(Vbb) U13.10(Vbb) U13.11(Vbb) U13.12(Vbb) U13.15(Vbb) U13.16(Vbb) U13.19(Vbb) U13.20(Vbb)
OUTVCC2: C37.1 CN4.1 D66.2(K) R40.5 R40.6 R40.7 R40.8 R46.5 R46.6 R46.7 R46.8 R50.1 R55.1 R60.1 U11.1(Vbb) U11.10(Vbb) U11.11(Vbb) U11.12(Vbb) U11.15(Vbb) U11.16(Vbb) U11.19(Vbb) U11.20(Vbb) U14.1(Vbb) U14.10(Vbb) U14.11(Vbb) U14.12(Vbb) U14.15(Vbb) U14.16(Vbb) U14.19(Vbb) U14.20(Vbb)
OUTVCC3: C43.1 CN5.1 D83.2(K) R65.5 R65.6 R65.7 R65.8 R71.1 R75.1 R125.2 R128.2 R130.1 U18.1(Vbb) U18.10(Vbb) U18.11(Vbb) U18.12(Vbb) U18.15(Vbb) U18.16(Vbb) U18.19(Vbb) U18.20(Vbb) U28.1(Vbb) U28.10(Vbb) U28.11(Vbb) U28.12(Vbb) U28.15(Vbb) U28.16(Vbb) U28.19(Vbb) U28.20(Vbb)
24V: FL1.1(IN) P2.2
#OUT1: CN3.2 D45.1 U10.18(OUT1)
#OUT2: CN3.3 D48.1 U10.17(OUT2)
#OUT3: CN3.4 D49.1 U10.14(OUT3)
#OUT4: CN3.5 D50.1 U10.13(OUT4)
#OUT5: CN3.6 D52.1 U13.18(OUT1)
#OUT6: CN3.7 D56.1 U13.17(OUT2)
#OUT7: CN3.8 D59.1 U13.14(OUT3)
#OUT8: CN3.9 D62.1 U13.13(OUT4)
#OUT9: CN4.2 D63.1 U11.18(OUT1)
#OUT10: CN4.3 D68.1 U11.17(OUT2)
#OUT11: CN4.4 D70.1 U11.14(OUT3)
#OUT12: CN4.5 D72.1 U11.13(OUT4)
#OUT13: CN4.6 D75.1 U14.18(OUT1)
#OUT14: CN4.7 D78.1 U14.17(OUT2)
#OUT15: CN4.8 D80.1 U14.14(OUT3)
#OUT16: CN4.9 D82.1 U14.13(OUT4)
#OUT17: CN5.2 D73.1 U18.18(OUT1)
#OUT18: CN5.3 D76.1 U18.17(OUT2)
#OUT19: CN5.4 D79.1 U18.14(OUT3)
#OUT20: CN5.5 D81.1 U18.13(OUT4)
#OUT21: CN5.6 D89.1 U28.18(OUT1)
#OUT22: CN5.7 D90.1 U28.17(OUT2)
CHIP_RST#: C24.1 KEY1.1 R20.1 U1.63(RST#)
DG1: DS2.3(g) R104.8
DG2: DS2.4(f) R104.7
DG3: DS2.6(b) R104.6
DG4: DS2.5(a) R104.5
DG5: DS2.10(dp) R105.8
DG6: DS2.1(d) R105.7
DG7: DS2.2(e) R105.6
DG8: DS2.8(c) R105.5
DIG1: R97.2 U1.43(PD27) U22.1(1A)
DIG2: R103.1 U1.44(PD28) U22.9(4A)
DIG3: R101.1 U1.45(PD29) U22.11(5A)
DIG4: R99.1 U1.46(PD30) U22.13(6A)
DIG5: R108.2 U1.38(PD23) U23.5(3A)
DIG6: R107.2 U1.40(PD24) U23.3(2A)
DIG7: R106.2 U1.41(PD25) U23.1(1A)
DIG8: R102.2 U1.42(PD26) U22.5(3A)
DQ1: R104.1 U22.2(1Y)
DQ2: R104.2 U22.8(4Y)
DQ3: R104.3 U22.10(5Y)
DQ4: R104.4 U22.12(6Y)
DQ5: R105.1 U23.6(3Y)
DQ6: R105.2 U23.4(2Y)
DQ7: R105.3 U23.2(1Y)
DQ8: R105.4 U22.6(3Y)
ELINK: P3.10 U1.104(PA18/ELINK#)
Error: R118.1 U1.106(PA20/PRD#)
IN1: CN1.2 D3.1 D7.2(K)
IN2: CN1.3 D11.1 D15.2(K)
IN3: CN1.4 D19.1 D23.2(K)
IN4: CN1.5 D27.1 D31.2(K)
IN5: CN1.6 D4.1 D8.2(K)
IN6: CN1.7 D12.1 D16.2(K)
IN7: CN1.8 D20.1 D24.2(K)
IN8: CN1.9 D28.1 D32.2(K)
IN9: CN2.2 D5.1 D9.2(K)
IN10: CN2.3 D13.1 D17.2(K)
IN11: CN2.4 D21.1 D25.2(K)
IN12: CN2.5 D29.1 D33.2(K)
IN13: CN2.6 D6.1 D10.2(K)
IN14: CN2.7 D14.1 D18.2(K)
IN15: CN2.8 D22.1 D26.2(K)
IN16: CN2.9 D30.1 D34.2(K)
INPUT1: PR1.5 U1.47(PD31) U2.16
INPUT2: PR1.6 U1.48(PB0/CTS0X/PWM0/TRAN0) U2.14
INPUT3: PR1.7 U1.49(PB1/DSR0X/CAT0/RECV0) U2.12
INPUT4: PR1.8 U1.50(PB2/RI0X/PWM1/TRAN1) U2.10
INPUT5: PR3.5 U1.51(PB3/DCD0X/CAT1/RECV1) U3.16
INPUT6: PR3.6 U1.52(PB4/DTR0X/PWM2) U3.14
INPUT7: PR3.7 U1.53(PB5/RTS0X/CAT2) U3.12
INPUT8: PR3.8 U1.57(PB6/PWM3/CAT3) U3.10
INPUT9: PR5.5 U1.59(PB16/ADCS) U4.16
INPUT10: PR5.6 U1.60(PB17/SCK1) U4.14
INPUT11: PR5.7 U1.61(PB18/SDO) U4.12
INPUT12: PR5.8 U1.62(PB19/SDI/SDX1) U4.10
INPUT13: PR7.5 U1.74(PD8) U5.16
INPUT14: PR7.6 U1.75(PD9) U5.14
INPUT15: PR7.7 U1.76(PD10) U5.12
INPUT16: PR7.8 U1.77(PD11) U5.10
INVCC1: C15.1 CN1.1 D1.2(K) R1.1
INVCC2: C25.1 CN2.1 D35.2(K) R15.1
K1: C70.2 R117.2 SW7.1(COMMON) U1.105(PA19/VBUS)
LD1: DS1.5(a) R87.8
LD2: DS1.6(b) R87.7
LD3: DS1.4(f) R87.6
LD4: DS1.3(g) R87.5
LD5: DS1.8(c) R93.8
LD6: DS1.2(e) R93.7
LD7: DS1.1(d) R93.6
LD8: DS1.10(dp) R93.5
LED1: R84.1 U1.107(PA21/PWR#) U20.9(4A)
LED2: R82.1 U1.31(PD16) U20.11(5A)
LED3: R80.1 U1.32(PD17) U20.13(6A)
LED4: R83.2 U1.33(PD18) U20.5(3A)
LED5: R81.2 U1.34(PD19) U20.3(2A)
LED6: R79.2 U1.35(PD20) U20.1(1A)
LED7: R109.1 U1.36(PD21) U23.9(4A)
LED8: R100.1 U1.37(PD22) U23.11(5A)
LQ1: R87.1 U20.8(4Y)
LQ2: R87.2 U20.10(5Y)
LQ3: R87.3 U20.12(6Y)
LQ4: R87.4 U20.6(3Y)
LQ5: R93.1 U20.4(2Y)
LQ6: R93.2 U20.2(1Y)
LQ7: R93.3 U23.8(4Y)
LQ8: R93.4 U23.10(5Y)
OUT1: U1.78(PD12) U6.2
OUT2: U1.79(PD13) U6.4
OUT3: U1.80(PD14) U6.6
OUT4: U1.81(PD15) U6.8
OUT5: U1.84(PA0) U7.2
OUT6: U1.85(PA1) U7.4
OUT7: U1.86(PA2) U7.6
OUT8: U1.87(PA3) U7.8
OUT9: U1.88(PA4/TWP0) U8.2
OUT10: U1.89(PA5/TWP1) U8.4
OUT11: U1.90(PA6/TACK) U8.6
OUT12: U1.91(PA7/DTR0/TNOW0/TDO) U8.8
OUT13: U1.93(PA12/CTS0) U9.2
OUT14: U1.94(PA13/DSR0/ELED#/TDI) U9.4
OUT15: U1.95(PA14/RI0/TCK) U9.6
OUT16: U1.96(PA15/DCD0/TMS) U9.8
OUT17: U1.97(PA8/RTS0/UID) U16.2
OUT18: U1.98(PA9/SLVI#/TRST#) U16.4
OUT19: U1.99(PA10/SLVA) U16.6
OUT20: U1.100(PA11/SLVCS#) U16.8
OUT21: U1.102(PA16/CTS1) U27.2
OUT22: U1.103(PA17/RTS1/TNOW1) U27.4
OUTPUT1: R27.4 U6.15 U10.3(IN1)
OUTPUT2: R27.3 U6.13 U10.5(IN2)
OUTPUT3: R27.2 U6.11 U10.7(IN3)
OUTPUT4: R27.1 U6.9 U10.9(IN4)
OUTPUT5: R32.4 U7.15 U13.3(IN1)
OUTPUT6: R32.3 U7.13 U13.5(IN2)
OUTPUT7: R32.2 U7.11 U13.7(IN3)
OUTPUT8: R32.1 U7.9 U13.9(IN4)
OUTPUT9: R41.4 U8.15 U11.3(IN1)
OUTPUT10: R41.3 U8.13 U11.5(IN2)
OUTPUT11: R41.2 U8.11 U11.7(IN3)
OUTPUT12: R41.1 U8.9 U11.9(IN4)
OUTPUT13: R47.4 U9.15 U14.3(IN1)
OUTPUT14: R47.3 U9.13 U14.5(IN2)
OUTPUT15: R47.2 U9.11 U14.7(IN3)
OUTPUT16: R47.1 U9.9 U14.9(IN4)
OUTPUT17: R66.4 U16.15 U18.3(IN1)
OUTPUT18: R66.3 U16.13 U18.5(IN2)
OUTPUT19: R66.2 U16.11 U18.7(IN3)
OUTPUT20: R66.1 U16.9 U18.9(IN4)
OUTPUT21: R126.1 U27.15 U28.3(IN1)
OUTPUT22: R129.1 U27.13 U28.5(IN2)
PB7: R2.2 S1.3 U1.58(PB7)
PC_RXD: CN6.2 U21.14(T1OUT)
PC_TXD: CN6.3 U21.13(R1IN)
PU1: R28.8 U6.1
PU2: R28.7 U6.3
PU3: R28.6 U6.5
PU4: R28.5 U6.7
PU5: R33.8 U7.1
PU6: R33.7 U7.3
PU7: R33.6 U7.5
PU8: R33.5 U7.7
PU9: R42.8 U8.1
PU10: R42.7 U8.3
PU11: R42.6 U8.5
PU12: R42.5 U8.7
PU13: R48.8 U9.1
PU14: R48.7 U9.3
PU15: R48.6 U9.5
PU16: R48.5 U9.7
PU17: R67.8 U16.1
PU18: R67.7 U16.3
PU19: R67.6 U16.5
PU20: R67.5 U16.7
PULLUP1: R26.4 U6.16
PULLUP2: R26.3 U6.14
PULLUP3: R26.2 U6.12
PULLUP4: R26.1 U6.10
PULLUP5: R31.4 U7.16
PULLUP6: R31.3 U7.14
PULLUP7: R31.2 U7.12
PULLUP8: R31.1 U7.10
PULLUP9: R40.4 U8.16
PULLUP10: R40.3 U8.14
PULLUP11: R40.2 U8.12
PULLUP12: R40.1 U8.10
PULLUP13: R46.4 U9.16
PULLUP14: R46.3 U9.14
PULLUP15: R46.2 U9.12
PULLUP16: R46.1 U9.10
PULLUP17: R65.4 U16.16
PULLUP18: R65.3 U16.14
PULLUP19: R65.2 U16.12
PULLUP20: R65.1 U16.10
RX_N: P3.6 R91.1 U1.11(RXN)
RX_P: P3.3 R94.2 U1.10(RXP)
RXD1: U1.112(PB10/RXD1/RXTX1) U21.12(R1OUT)
ST1: D57.2 U10.4(ST1_2) U10.8(ST3_4)
ST2: D61.2 U13.4(ST1_2) U13.8(ST3_4)
ST3: D67.2 U11.4(ST1_2) U11.8(ST3_4)
ST4: D71.2 U14.4(ST1_2) U14.8(ST3_4)
ST5: D77.2 U18.4(ST1_2) U18.8(ST3_4)
ST6: D93.2 U28.4(ST1_2) U28.8(ST3_4)
SW1: PC5.5 PR9.4 U1.110(PB8/RXD0)
SW2: PC5.6 PR9.3 U1.111(PB9/TXD0)
SW3: PC5.7 PR9.2 U1.114(PB12/SCS)
SW4: PC5.8 PR9.1 U1.115(PB13/SCK0)
SW5: PC6.5 PR10.8 U1.116(PB14/MOSI)
SW6: PC6.6 PR10.7 U1.117(PB15/MISO/SDX0)
SW7: PC6.7 PR10.6 U1.118(PD0)
SW8: PC6.8 PR10.5 U1.119(PD1)
SW9: C69.2 R115.2 SW17.6 U1.120(PD2)
SW10: C68.2 R114.2 SW17.5 U1.121(PD3)
SW11: C67.2 R113.2 SW17.4 U1.123(PD4)
SW12: C66.2 R112.2 SW17.3 U1.124(PD5)
SW13: C65.2 R111.2 SW17.2 U1.125(PD6)
SW14: C64.2 R110.2 SW17.1 U1.126(PD7)
TX_N: P3.2 R95.1 U1.15(TXN)
TX_P: P3.1 R96.1 U1.14(TXP)
TXD1: U1.113(PB11/TXD1) U21.11(T1IN)
UD_N: P1.2(UD-) U1.24(DN)
UD_P: P1.3(UD+) U1.25(DP)
NetC26_1: C26.1 U1.20(XO) X1.2(P2)
NetC27_1: C27.1 U1.19(XI) X1.1(P1)
NetC31_1: C31.1 C32.2 D53.2(K) L1.2 U12.1(Vin)
NetC33_1: C33.1 C34.2 L2.2 R37.2 R38.1 R43.2
NetC36_1: C36.1 C38.1 R51.2 U15.2(VOUT)
NetC41_1: C41.1 C42.1 R58.2 U17.2(VOUT)
NetC45_1: C45.1 C46.1 R77.2 U19.2(VOUT)
NetC49_1: C49.1 U21.3(C1-)
NetC49_2: C49.2 U21.1(C1+)
NetC50_2: C50.2 U21.2(V+)
NetC51_1: C51.1 U21.5(C2-)
NetC51_2: C51.2 U21.4(C2+)
NetC54_2: C54.2 U21.6(V-)
NetD2_1: D2.1 R1.2
NetD3_2: D3.2 PC1.5 PR2.8 R3.1
NetD4_2: D4.2 PC2.5 PR4.8 R4.1
NetD5_2: D5.2 PC3.5 PR6.8 R5.1
NetD6_2: D6.2 PC4.5 PR8.8 R6.1
NetD7_1: D7.1(A) D15.1(A) D23.1(A) D31.1(A) D37.1(A) D41.1(A)
NetD8_1: D8.1(A) D16.1(A) D24.1(A) D32.1(A) D38.1(A) D42.1(A)
NetD9_1: D9.1(A) D17.1(A) D25.1(A) D33.1(A) D39.1(A) D43.1(A)
NetD10_1: D10.1(A) D18.1(A) D26.1(A) D34.1(A) D40.1(A) D44.1(A)
NetD11_2: D11.2 PC1.6 PR2.7 R7.1
NetD12_2: D12.2 PC2.6 PR4.7 R8.1
NetD13_2: D13.2 PC3.6 PR6.7 R9.1
NetD14_2: D14.2 PC4.6 PR8.7 R10.1
NetD19_2: D19.2 PC1.7 PR2.6 R11.1
NetD20_2: D20.2 PC2.7 PR4.6 R12.1
NetD21_2: D21.2 PC3.7 PR6.6 R13.1
NetD22_2: D22.2 PC4.7 PR8.6 R14.1
NetD27_2: D27.2 PC1.8 PR2.5 R16.1
NetD28_2: D28.2 PC2.8 PR4.5 R17.1
NetD29_2: D29.2 PC3.8 PR6.5 R18.1
NetD30_2: D30.2 PC4.8 PR8.5 R19.1
NetD36_1: D36.1 R15.2
NetD37_2: D37.2(K) PC1.1 PC1.2 PC1.3 PC1.4 PR2.1 PR2.2 PR2.3 PR2.4 U2.2 U2.4 U2.6 U2.8
NetD38_2: D38.2(K) PC2.1 PC2.2 PC2.3 PC2.4 PR4.1 PR4.2 PR4.3 PR4.4 U3.2 U3.4 U3.6 U3.8
NetD39_2: D39.2(K) PC3.1 PC3.2 PC3.3 PC3.4 PR6.1 PR6.2 PR6.3 PR6.4 U4.2 U4.4 U4.6 U4.8
NetD40_2: D40.2(K) PC4.1 PC4.2 PC4.3 PC4.4 PR8.1 PR8.2 PR8.3 PR8.4 U5.2 U5.4 U5.6 U5.8
NetD45_2: D45.2 R25.1
NetD47_1: D47.1 R24.2
NetD48_2: D48.2 R29.1
NetD49_2: D49.2 R30.1
NetD50_2: D50.2 R34.1
NetD51_1: D51.1 R35.1
NetD52_2: D52.2 R39.1
NetD54_2: D54.2(K) D57.1 R45.2
NetD56_2: D56.2 R44.1
NetD58_2: D58.2(K) L2.1 U12.2(Output)
NetD59_2: D59.2 R49.1
NetD60_2: D60.2(K) D61.1 R52.2
NetD62_2: D62.2 R53.1
NetD63_2: D63.2 R54.1
NetD64_2: D64.2(K) D67.1 R55.2
NetD65_1: D65.1 R50.2
NetD68_2: D68.2 R56.1
NetD69_2: D69.2(K) D71.1 R60.2
NetD70_2: D70.2 R57.1
NetD72_2: D72.2 R62.1
NetD73_2: D73.2 R64.1
NetD74_2: D74.2(K) D77.1 R71.2
NetD75_2: D75.2 R68.1
NetD76_2: D76.2 R70.1
NetD78_2: D78.2 R72.1
NetD79_2: D79.2 R73.1
NetD80_2: D80.2 R74.1
NetD81_2: D81.2 R76.1
NetD82_2: D82.2 R78.1
NetD84_1: D84.1 R75.2
NetD87_2: D87.2 R118.2
NetD89_2: D89.2 R122.1
NetD90_2: D90.2 R123.1
NetD93_1: D93.1 D94.2(K) R130.2
NetF1_2: F1.2 SW1.2(NC)
NetFL1_2: FL1.2(OUT) L1.1 R35.2
NetP1_1: P1.1(+5V) SW1.1(COMMON)
NetP3_9: P3.9 R98.2
NetPR9_5: PR9.5 PR12.4 SW2.4(1)
NetPR9_6: PR9.6 PR12.3 SW2.3(2)
NetPR9_7: PR9.7 PR12.2 SW2.2(4)
NetPR9_8: PR9.8 PR12.1 SW2.1(8)
NetPR10_1: PR10.1 PR11.4 SW3.4(1)
NetPR10_2: PR10.2 PR11.3 SW3.3(2)
NetPR10_3: PR10.3 PR11.2 SW3.2(4)
NetPR10_4: PR10.4 PR11.1 SW3.1(8)
NetR3_2: R3.2 U2.1
NetR4_2: R4.2 U3.1
NetR5_2: R5.2 U4.1
NetR6_2: R6.2 U5.1
NetR7_2: R7.2 U2.3
NetR8_2: R8.2 U3.3
NetR9_2: R9.2 U4.3
NetR10_2: R10.2 U5.3
NetR11_2: R11.2 U2.5
NetR12_2: R12.2 U3.5
NetR13_2: R13.2 U4.5
NetR14_2: R14.2 U5.5
NetR16_2: R16.2 U2.7
NetR17_2: R17.2 U3.7
NetR18_2: R18.2 U4.7
NetR19_2: R19.2 U5.7
NetR21_2: R21.2 U1.65(AVRB)
NetR22_2: R22.2 U1.6(RSETE)
NetR23_2: R23.2 U1.23(RSETU)
NetR36_2: R36.2 R37.1 R38.2 U12.4(Feedback)
NetR124_2: R124.2 U27.1
NetR125_1: R125.1 U27.16
NetR127_2: R127.2 U27.3
NetR128_1: R128.1 U27.14

Not connected (* = marked no-connect by the designer): CN6 1* 4* 6* 7* 8* 9*; KEY1 2 4; P3 7 11 12; SW1 3(NO); SW7 3(NO); U1 3(RSVD1)* 8(RSVD2)* 66(AVRT)* 67(AIN2)* 68(AIN1)* 69(AIN0)* 73(DBG)* 127(PECLN)* 128(PECLP)*; U21 7(T2OUT) 8(R2IN) 9(R2OUT) 10(T2IN); U22 3(2A)* 4(2Y)*; U23 12(6Y)* 13(6A)*; U27 5* 6* 7* 8* 9* 10* 11* 12*; U28 7(IN3)* 9(IN4)* 13(OUT4)* 14(OUT3)*

## Layout directives
differential pair: (no net found under the mark)

## Notes on the sheet
- PNP INPUT
- CH563L
- (near S1) 红色按键
- C=0.1UF
- R=100K
- R=4.7K
- 方案二：焊电阻，将PB7直接下拉；
- (near R2) 方案一：焊按键，在烧写程序时可以，先按下按键，再连接USB线；
- (near KEY1) 黑色按键
- CH563L片上Memory：
- (near F1) 电源开关
- 2、SRAM：共有128K;
- 1、Flash：480K，其中256K可以用于Bootloader;
- 3、EEPROM：共有28K;
- (near F1) 供电/下载程序（备选）
- 考虑放置均布电容，提高整块板子的抗干扰能力。
- OUTPUT
- Power
- 未接急停时，所有的输出都为高电平；
- (near R69) 磁珠
- RS232
- Ethernet
- Nixie tube
- IP SET
- 注意封装引脚与原理图引脚的对应关系；
- DisPlay
- IO不够用；
- KEY
- Screw
- 取样品验证封装；
- (near PR9) 4.7K
- (near PR12) 22K
- (near PC5) 0.1uF
- (near C49) 电容1206封装
- (near PR10) 4.7K
- (near PR11) 22K
- (near PC6) 0.1uF
- MODE
- (in symbol CAPACITOR POL) +
- (in symbol HR911105A) J8; RD-; J7; J6; RX-; J5; RD+; J4; TD-; J3; RX+; J2; TX-; J1; TX+; TD+; NC; 1000pF; 4X75 ohms; 2KV; GND
- (in symbol RES-4, part B) 100K

## Library data of the parts
A1-A6 = Header 11: Header, 11-Pin; LatestRevisionDate: 17-Jul-2002; LatestRevisionNote: Re-released for DXP Platform.; Publisher: Altium Limited
C1-C14 C16-C24 C26-C28 C30 C32 C34-C37 C39 C40 C42 C44 C45 C47-C51 C54 C56 C60-C63 = CAP: Capacitor
C15 C25 C43 C64-C70 = Cap: Capacitor; Published: 8-Jun-2000; LatestRevisionDate: 17-Jul-2002; LatestRevisionNote: Re-released for DXP Platform.; PackageReference: RAD-0.3; Publisher: Altium Limited
  C15 C25 C43: Value: 0.1uF
C29 C31 C33 = CAPACITOR POL: Capacitor
C38 C41 C46 = ELECTRO1: Electrolytic Capacitor
CN1-CN4 = CON10: Connector
D1 D7-D10 D15-D18 D23-D26 D31-D35 D37-D40 D46 D53 D54 D60 D64 D66 D69 D74 D83 D94 = D Zener: Zener Diode; Published: 8-Jun-2000; LatestRevisionDate: 17-Jul-2002; LatestRevisionNote: Re-released for DXP Platform.; PackageReference: DIODE-0.7; Publisher: Altium Limited
D3-D6 D11-D14 D19-D22 D27-D30 D45 D48-D50 D52 D56 D59 D62 D63 D68 D70 D72 D73 D75 D76 D78-D82 D88-D90 = GLEDDIP
D41-D44 = Diode 1N4148: High Conductance Fast Diode; Published: 8-Jun-2000; LatestRevisionDate: 17-Jul-2002; LatestRevisionNote: Re-released for DXP Platform.; DatasheetDocument: 1997; PackageReference: DO-35; Publisher: Altium Limited; Code_JEDEC: DO-204-AH; ComponentLink1Description: Manufacturer Link; ComponentLink1URL: http://www.fairchildsemi.com/; ComponentLink2Description: Datasheet; ComponentLink2URL: http://www.fairchildsemi.com/ds/1N%2F1N4148.pdf
D55 D58 = Diode 1N5408: 3 Amp Medium Power Silicon Rectifier Diode; Published: 8-Jun-2000; LatestRevisionDate: 17-Jul-2002; LatestRevisionNote: Re-released for DXP Platform.; DatasheetDocument: Aug-1984; PackageReference: DO-201AD; Publisher: Altium Limited; ComponentLink1Description: Manufacturer Link; ComponentLink1URL: http://www.irf.com/
F1 = FUSE1: Fuse
L1 L2 = Inductor: Code_IEC: 1005; Published: 8-Jun-2000; LatestRevisionDate: 17-Jul-2002; LatestRevisionNote: Re-released for DXP Platform.; PackageReference: 0402-A; Publisher: Altium Limited; Code_JEITA: 0402
P1 = USB: USB Port
P2 = Header 3H: Header, 3-Pin, Right Angle; LatestRevisionDate: 17-Jul-2002; LatestRevisionNote: Re-released for DXP Platform.; Publisher: Altium Limited
R1-R21 R24 R25 R29 R30 R34 R39 R44 R45 R49 R50 R52-R57 R59-R64 R68-R76 R78-R84 R97-R103 R106-R118 R122-R130 = RES2
R22 R23 = DZ
R26-R28 R31-R33 R40-R42 R46-R48 R65-R67 R87 R93 R104 R105 = MNR34: 3216x4 Resistor Array; Fitted: *
R35-R37 R43 R51 R58 R77 = Res2: Resistor; Published: 8-Jun-2000; LatestRevisionDate: 17-Jul-2002; LatestRevisionNote: Re-released for DXP Platform.; PackageReference: AXIAL-0.4; Publisher: Altium Limited
R38 = Res2: Resistor; Value: 1K; Published: 8-Jun-2000; LatestRevisionDate: 17-Jul-2002; LatestRevisionNote: Re-released for DXP Platform.; PackageReference: AXIAL-0.4; Publisher: Altium Limited
R91 R94-R96 = R
S1 = Pro1BB.tmp_UnNamed_19
SW1 SW7 = SW SPDT
U1 = CH563L: 32bit MCU with USB OTG 2.0 & 100M Ethernet
U15 U17 U19 = AS1117
U20 U22 U23 = SN7406: HEX INVERTER BUFFERS/DRIVERS
U21 = MAX3232CSE
X1 = 30MHZ: Crystal Oscillator